# EAGLE board MAIN_FM (EAGLE 5.11), part 1 of 2
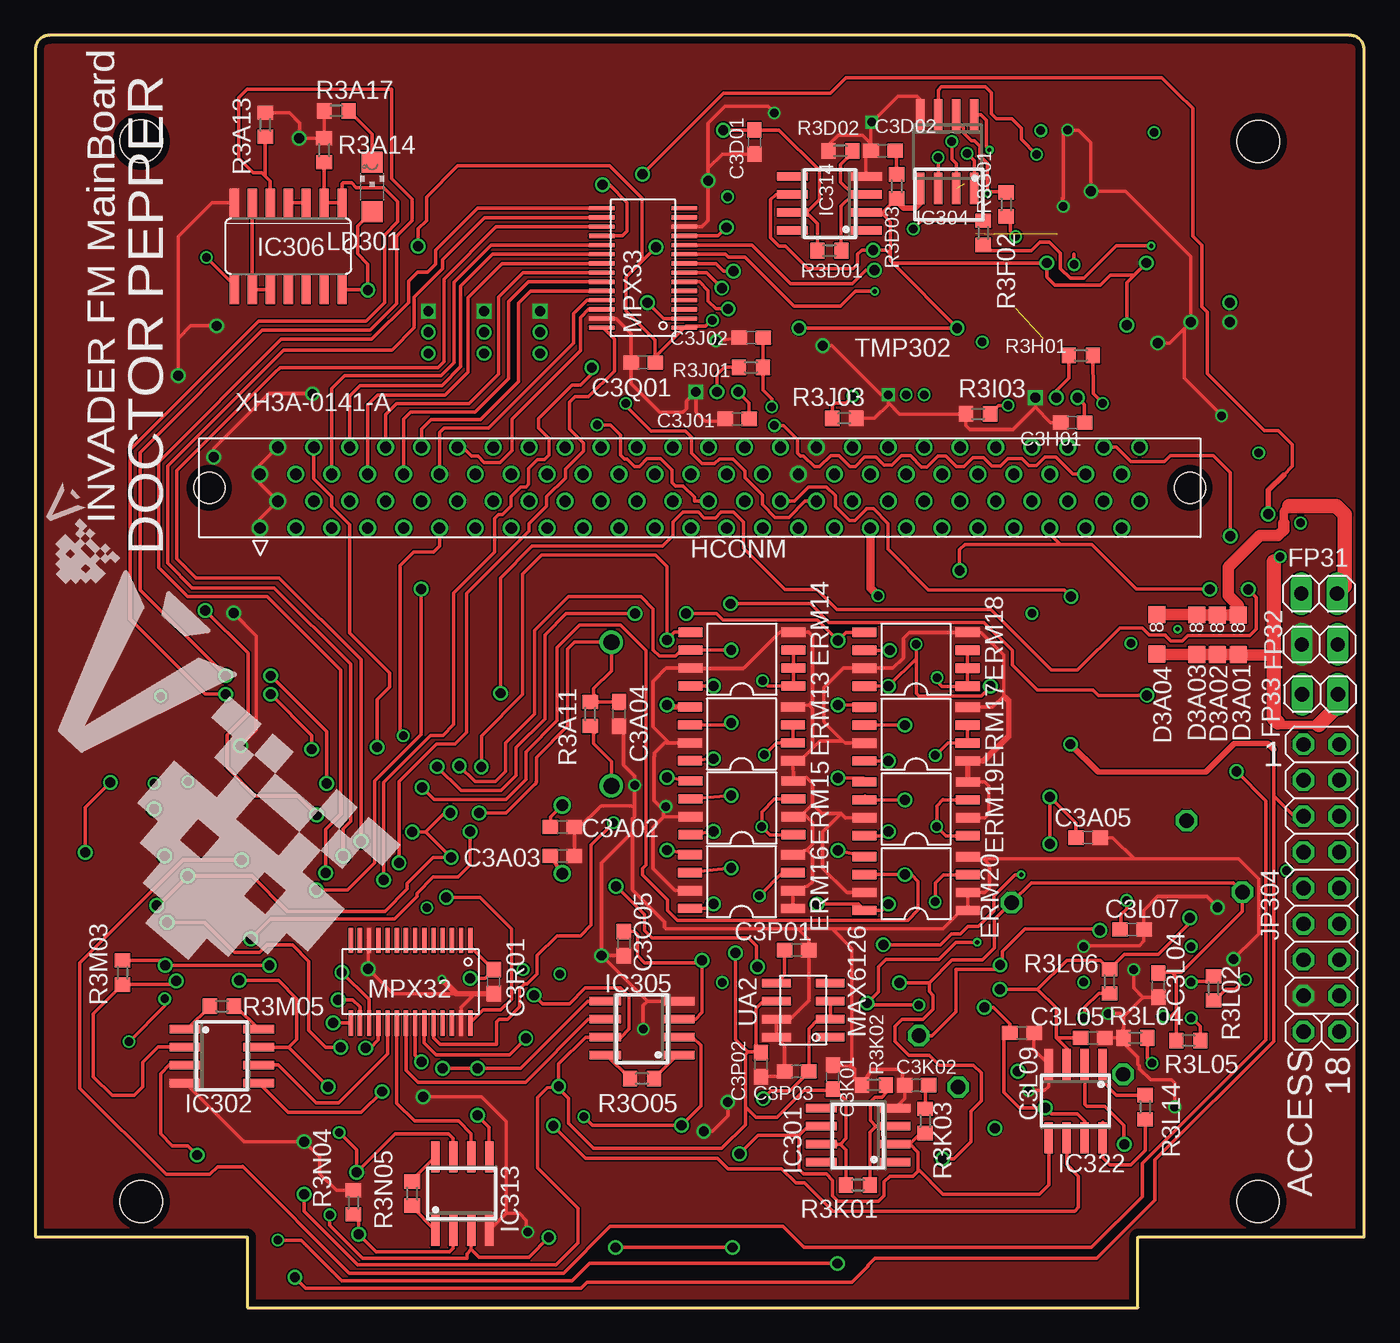
[diagram p7: board, top side]
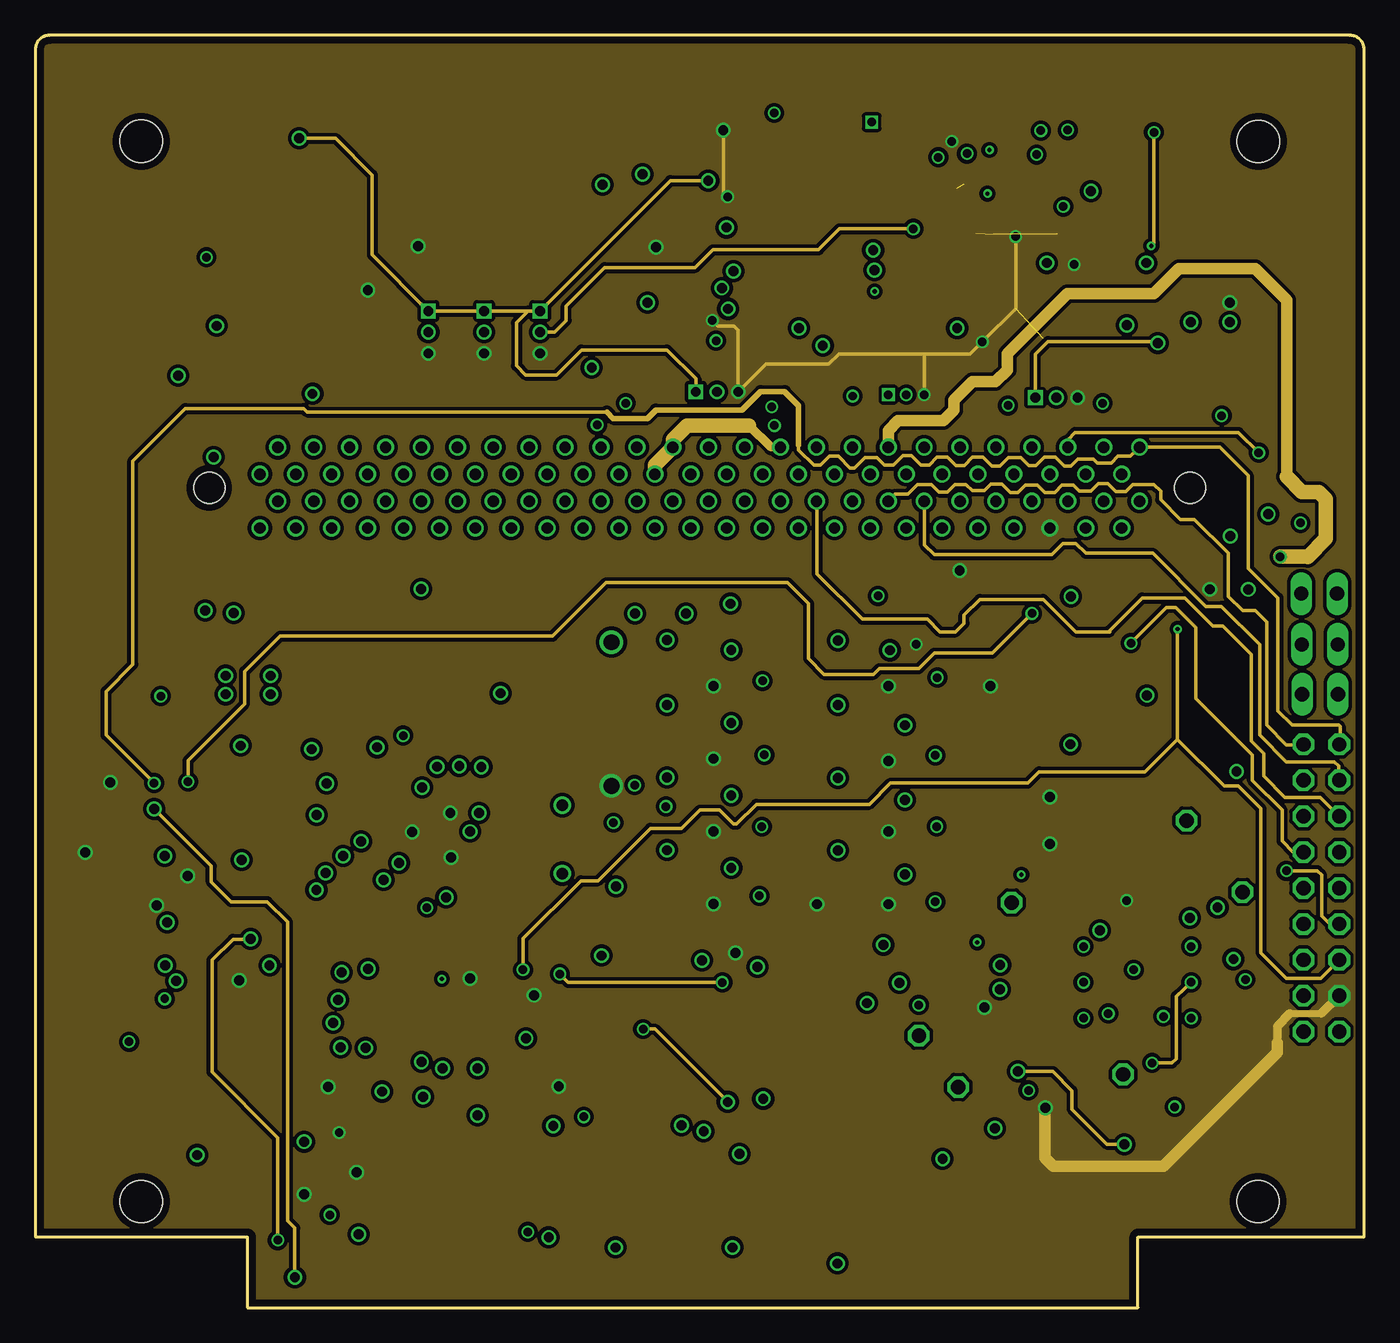
[diagram p8: board, inner layer Route2]
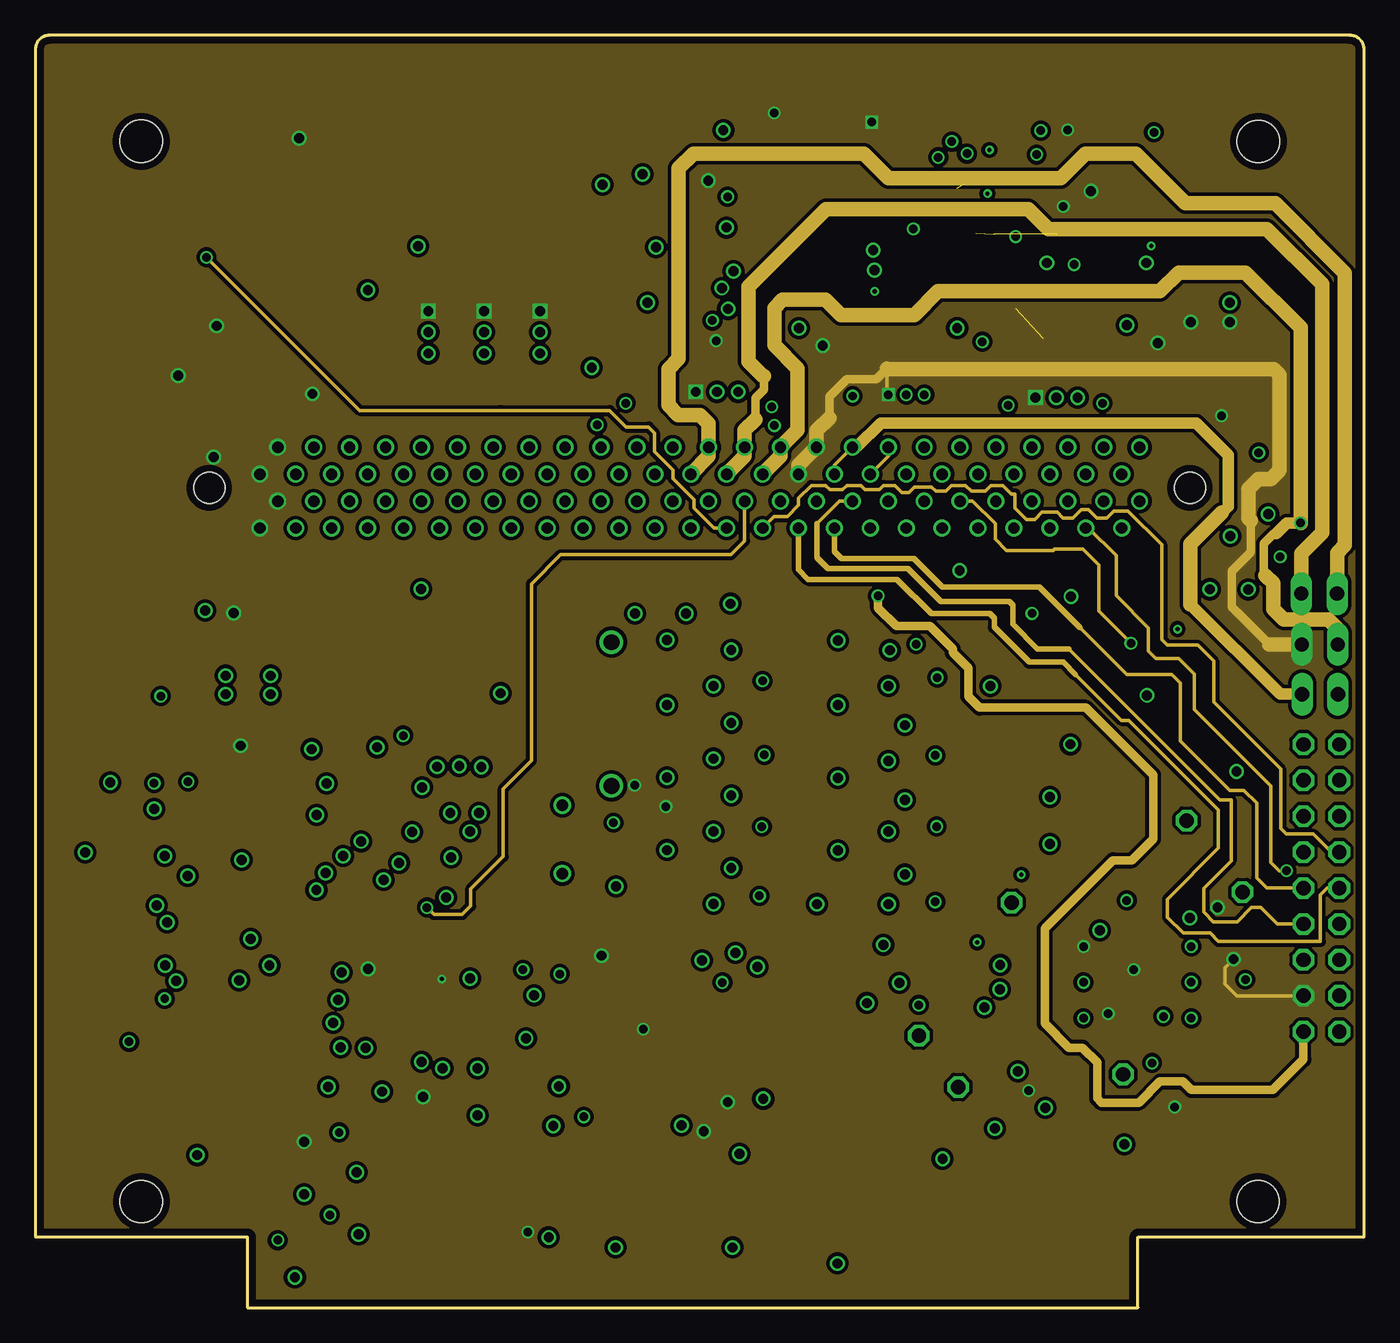
[diagram p9: board, inner layer Route15]
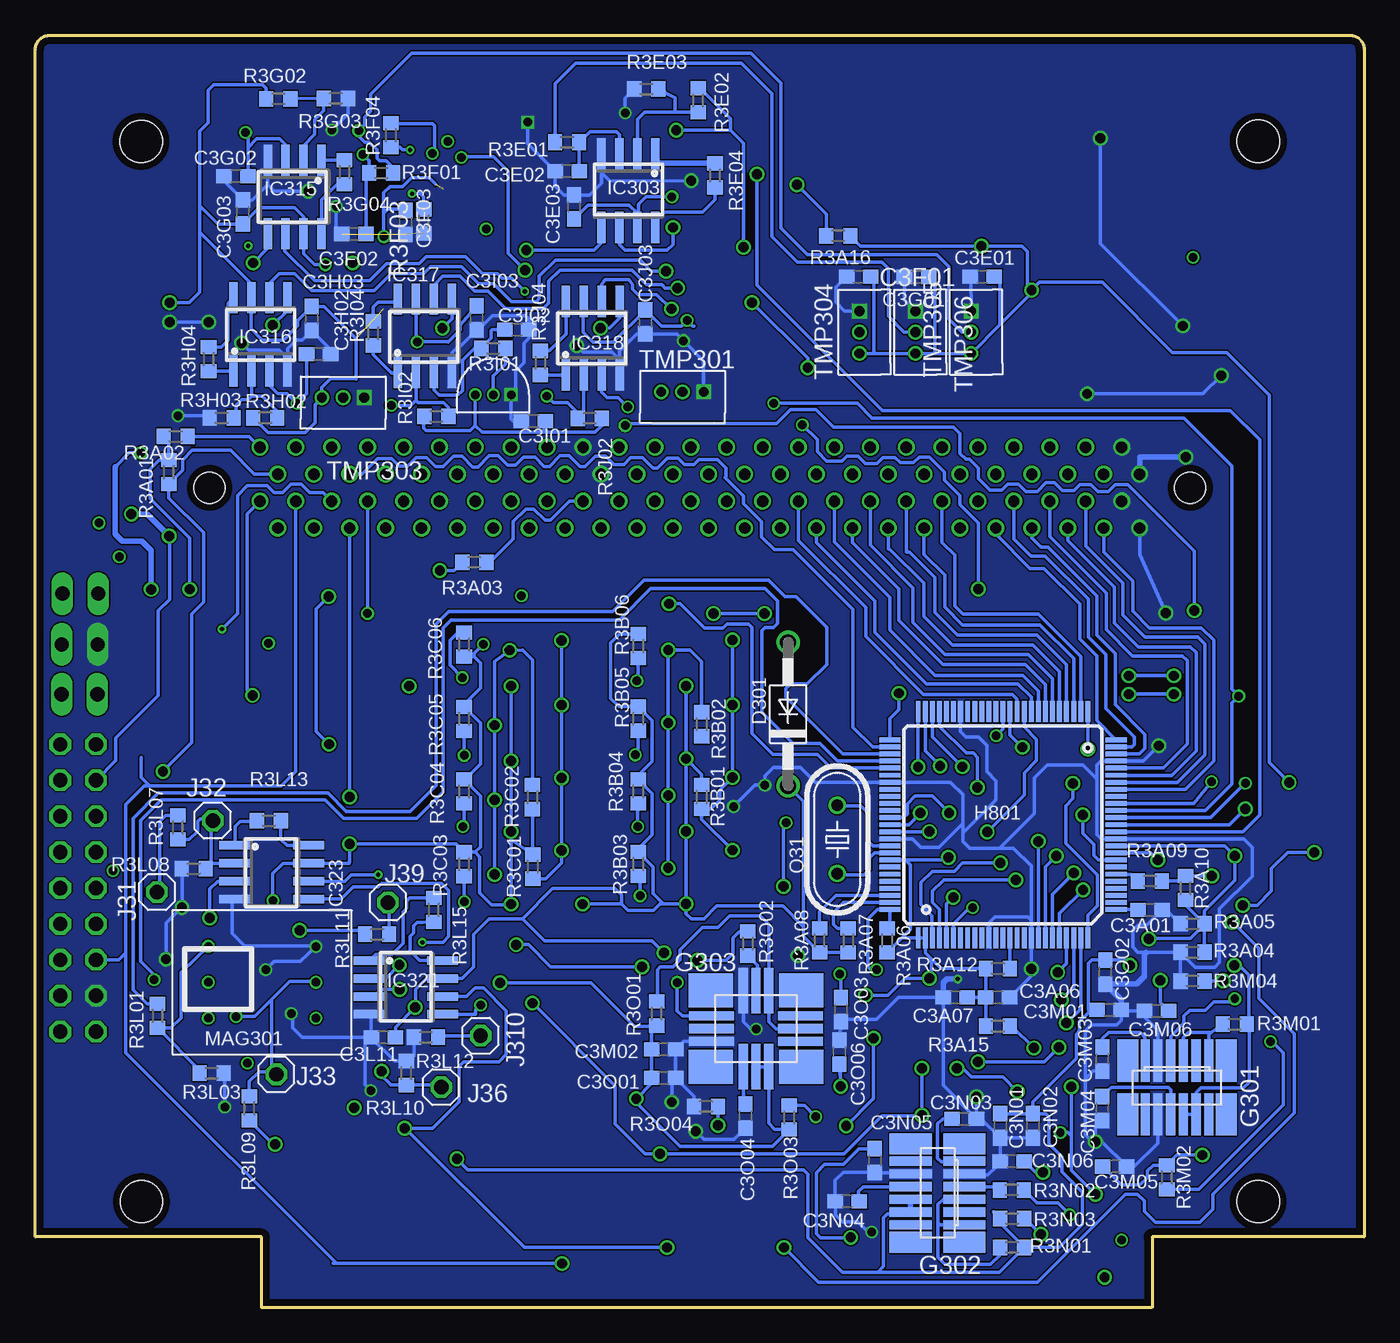
[diagram p10: board, bottom side, seen from below]

Size 94 x 90 mm. Coordinates in mm from the lower left corner, seen from the top.
Outline: 0,5 15,5 15,0 78,0 78,5 94,5 94,89 arc92 92.97,90 1,90 arc90 0,89 0,5
Copper layers (1+2*15+16): Top 0.018mm / dielectric 0.25mm / Route2 0.035mm / dielectric 1mm / Route15 0.035mm / dielectric 0.25mm / Bottom 0.018mm
Design rules "pban_4mil-l4": minimum track width 0.1mm, minimum drill 0.3mm, track to track 0.1mm, track to pad 0.229mm, pad to pad 0.1mm, via to via 0.1mm, smd to smd 0.1mm, copper to edge 0.5mm, drill to drill 0.5mm, minimum pad ring 0.15mm, minimum via ring 0.15mm, stop-mask expansion 4mil, vias tented up to drill 0.35mm, thermal gap 10mil
Holes 3 mm at 86.52,82.49 86.49,7.5 7.5,7.5 7.49,82.5

## Footprints (pad centres in the part's own frame; a part is rotated, then mirrored left to right if it is on the bottom)
C0603 = smd 1.1 x 1: 1 -0.85,0; 2 0.85,0
DIODE_FM = smd 1.2 x 1.2: P$1 -1.4,0; P$2 1.4,0
DO41-10 = drill 1.118 round: A 5.08,0; C -5.08,0
SOIC8 = smd 0.65 x 1.7: 1 -1.9,-3.65; 2 -0.63,-3.65; 3 0.64,-3.65; 4 1.91,-3.65; 5 1.91,3.65; 6 0.64,3.65; 7 -0.63,3.65; 8 -1.9,3.65
1X02 = drill 1.016 long: 1 -1.27,0; 2 1.27,0
CRM200 = smd 3 x 0.65: BIT_OUT -1.92,1.31; BW_CAP -1.92,-2.29; CBIT 1.88,2.21; MODE_SEL -1.92,-1.39; PROG 1.88,0.41; RATE_OUT -1.92,-0.49; RESET 1.88,-2.29; SEL0 -1.92,2.21; SEL1 -1.92,0.41; VDD 1.88,1.31; VREF_CAP 1.88,-0.49; VSS 1.88,-1.39 | smd 3 x 1.5: NEC1 -1.92,3.44; NEC2 -1.92,-3.52; NEC3 1.88,-3.52; NEC4 1.88,3.44
CRM100 = smd 3.2 x 0.65: BIT_OUT -3.15,-0.97; BW_CAP 3.15,-0.97; CBIT -3.15,0.83; RESET 3.15,-0.07; SEL0 -3.15,-0.07; VSS 3.15,0.83 | smd 0.65 x 3.2: MODE_SEL 0.9,-2.76; PROG 0,2.62; RATE_OUT 0,-2.76; SEL1 -0.9,-2.76; VDD -0.9,2.62; VREF_CAP 0.9,2.62 | smd 3.15 x 2.4: NEC1 -3.2,2.63; NEC2 -3.2,-2.77; NEC3 3.2,-2.77; NEC4 3.2,2.63
H8-3069 = smd 1.5 x 0.35: 1 -8,6; 2 -8,5.5; 3 -8,5; 4 -8,4.5; 5 -8,4; 6 -8,3.5; 7 -8,3; 8 -8,2.5; 9 -8,2; 10 -8,1.5; 11 -8,1; 12 -8,0.5; 13 -8,0; 14 -8,-0.5; 15 -8,-1; 16 -8,-1.5; 17 -8,-2; 18 -8,-2.5; 19 -8,-3; 20 -8,-3.5; 21 -8,-4; 22 -8,-4.5; 23 -8,-5; 24 -8,-5.5; 25 -8,-6; 51 8,-6; 52 8,-5.5; 53 8,-5; 54 8,-4.5; 55 8,-4; 56 8,-3.5; 57 8,-3; 58 8,-2.5; 59 8,-2; 60 8,-1.5; 61 8,-1; 62 8,-0.5; 63 8,0; 64 8,0.5; 65 8,1; 66 8,1.5; 67 8,2; 68 8,2.5; 69 8,3; 70 8,3.5; 71 8,4; 72 8,4.5; 73 8,5; 74 8,5.5; 75 8,6 | smd 0.35 x 1.5: 26 -6,-8; 27 -5.5,-8; 28 -5,-8; 29 -4.5,-8; 30 -4,-8; 31 -3.5,-8; 32 -3,-8; 33 -2.5,-8; 34 -2,-8; 35 -1.5,-8; 36 -1,-8; 37 -0.5,-8; 38 0,-8; 39 0.5,-8; 40 1,-8; 41 1.5,-8; 42 2,-8; 43 2.5,-8; 44 3,-8; 45 3.5,-8; 46 4,-8; 47 4.5,-8; 48 5,-8; 49 5.5,-8; 50 6,-8; 76 6,8; 77 5.5,8; 78 5,8; 79 4.5,8; 80 4,8; 81 3.5,8; 82 3,8; 83 2.5,8; 84 2,8; 85 1.5,8; 86 1,8; 87 0.5,8; 88 0,8; 89 -0.5,8; 90 -1,8; 91 -1.5,8; 92 -2,8; 93 -2.5,8; 94 -3,8; 95 -3.5,8; 96 -4,8; 97 -4.5,8; 98 -5,8; 99 -5.5,8; 100 -6,8
XH3A-0141-A = drill 0.8 round: A1 -31.115,-2.857; A2 -29.845,-0.953; A3 -28.575,-2.857; A4 -27.305,-0.953; A5 -26.035,-2.857; A6 -24.765,-0.953; A7 -23.495,-2.857; A8 -22.225,-0.953; A9 -20.955,-2.857; A10 -19.685,-0.953; A11 -18.415,-2.857; A12 -17.145,-0.953; A13 -15.875,-2.857; A14 -14.605,-0.953; A15 -13.335,-2.857; A16 -12.065,-0.953; A17 -10.795,-2.857; A18 -9.525,-0.953; A19 -8.255,-2.857; A20 -6.985,-0.953; A21 -5.715,-2.857; A22 -4.445,-0.953; A23 -3.175,-2.857; A24 -1.905,-0.953; A25 -0.635,-2.857; A26 0.635,-0.953; A27 1.905,-2.857; A28 3.175,-0.953; A29 4.445,-2.857; A30 5.715,-0.953; A31 6.985,-2.857; A32 8.255,-0.953; A33 9.525,-2.857; A34 10.795,-0.953; A35 12.065,-2.857; A36 13.335,-0.953; A37 14.605,-2.857; A38 15.875,-0.953; A39 17.145,-2.857; A40 18.415,-0.953; A41 19.685,-2.857; A42 20.955,-0.953; A43 22.225,-2.857; A44 23.495,-0.953; A45 24.765,-2.857; A46 26.035,-0.953; A47 27.305,-2.857; A48 28.575,-0.953; A49 29.845,-2.857; A50 31.115,-0.953; B1 -31.115,0.953; B2 -29.845,2.857; B3 -28.575,0.953; B4 -27.305,2.857; B5 -26.035,0.953; B6 -24.765,2.857; B7 -23.495,0.953; B8 -22.225,2.857; B9 -20.955,0.953; B10 -19.685,2.857; B11 -18.415,0.953; B12 -17.145,2.857; B13 -15.875,0.953; B14 -14.605,2.857; B15 -13.335,0.953; B16 -12.065,2.857; B17 -10.795,0.953; B18 -9.525,2.857; B19 -8.255,0.953; B20 -6.985,2.857; B21 -5.715,0.953; B22 -4.445,2.857; B23 -3.175,0.953; B24 -1.905,2.857; B25 -0.635,0.953; B26 0.635,2.857; B27 1.905,0.953; B28 3.175,2.857; B29 4.445,0.953; B30 5.715,2.857; B31 6.985,0.953; B32 8.255,2.857; B33 9.525,0.953; B34 10.795,2.857; B35 12.065,0.953; B36 13.335,2.857; B37 14.605,0.953; B38 15.875,2.857; B39 17.145,0.953; B40 18.415,2.857; B41 19.685,0.953; B42 20.955,2.857; B43 22.225,0.953; B44 23.495,2.857; B45 24.765,0.953; B46 26.035,2.857; B47 27.305,0.953; B48 28.575,2.857; B49 29.845,0.953; B50 31.115,2.857 | hole 2.2: -34.7,0; 34.67,0
SO8 = smd 0.6 x 2.2: 1 -1.905,-2.6; 2 -0.635,-2.6; 3 0.635,-2.6; 4 1.905,-2.6; 5 1.905,2.6; 6 0.635,2.6; 7 -0.635,2.6; 8 -1.905,2.6
SO14 = smd 0.66 x 2.032: 1 -3.81,-3.073; 2 -2.54,-3.073; 3 -1.27,-3.073; 4 0,-3.073; 5 1.27,-3.073; 6 2.54,-3.073; 7 3.81,-3.073; 8 3.81,3.073; 9 2.54,3.073; 10 1.27,3.073; 11 0,3.073; 12 -1.27,3.073; 13 -2.54,3.073; 14 -3.81,3.073
1X01 = drill 1.016 octagon: 1 0,0
2X08 = drill 1.016 octagon: 1 -8.89,-1.27; 2 -8.89,1.27; 3 -6.35,-1.27; 4 -6.35,1.27; 5 -3.81,-1.27; 6 -3.81,1.27; 7 -1.27,-1.27; 8 -1.27,1.27; 9 1.27,-1.27; 10 1.27,1.27; 11 3.81,-1.27; 12 3.81,1.27; 13 6.35,-1.27; 14 6.35,1.27; 15 8.89,-1.27; 16 8.89,1.27
CHIPLED_1206 = smd 1.5 x 1.5: A 0,-1.75; C 0,1.75
AMI302 = drill 0.6 round: CH1 -3.81,2.54; CH2 -3.81,0; CS -3.81,-2.54; GND 3.81,2.54; VDD 3.81,0; VO 3.81,-2.54
ADG707 = smd 1.8 x 0.3: A0 2.925,-2.925; A1 2.925,-3.575; A2 2.925,-4.225; DA 2.925,4.225; DB -2.925,3.575; EN 2.925,-2.275; GND1 -2.925,-2.925; GND2 2.925,3.575; NC -2.925,-3.575; NC1 -2.925,2.925; NC2 -2.925,-4.225; S1A 2.925,-1.625; S1B -2.925,-2.275; S2A 2.925,-0.975; S2B -2.925,-1.625; S3A 2.925,-0.325; S3B -2.925,-0.975; S4A 2.925,0.325; S4B -2.925,-0.325; S5A 2.925,0.975; S5B -2.925,0.325; S6A 2.925,1.625; S6B -2.925,0.975; S7A 2.925,2.275; S7B -2.925,1.625; S8A 2.925,2.925; S8B -2.925,2.275; VDD -2.925,4.225
HC49/S = drill 0.813 round: 1 -2.413,0; 2 2.413,0
R0603 = smd 1 x 1.1: 1 -0.85,0; 2 0.85,0
LM19_XH = drill 0.7 round: 1 -1.5,0; 2 0,0 | drill 0.7 square: 3 1.5,0
LM19 = drill 0.6 round: +VS 1.27,0; VOUT 0,0 | drill 0.6 square: GND -1.27,0
MAX6126 = smd 0.61 x 2.032: GND -1.27,2.54; GNDS -2.54,2.54; I.C.1 1.27,-1.27; I.C.2 -2.54,-1.27; IN 0,2.54; NR 1.27,2.54; OUTF 0,-1.27; OUTS -1.27,-1.27

## Placement (x,y rotation side)
C3A01  0.1u  [C0603]  15.15,28.14 0 bottom
C3A02  15pF  [C0603]  37.28,34 0 top
C3A03  15pF  [C0603]  37.28,31.95 0 top
C3A04  10uF  [C0603]  41.28,41.99 270 top
C3A05  10u  [C0603]  74.46,33.24 0 top
C3A06  0.1u  [C0603]  25.91,21.94 0 bottom
C3A07  0.1u  [C0603]  28.93,21.94 180 bottom
C3D01  0.1u  [C0603]  50.86,82.45 270 top
C3D02  1n  [C0603]  59.96,81.83 180 top
C3E01  0.1u  [C0603]  27.02,72.94 180 bottom
C3E02  10u  [C0603]  56.38,80.4 180 bottom
C3E03  0.1u  [C0603]  55.89,77.86 90 bottom
C3F01  0.1u  [C0603]  35.77,72.94 180 bottom
C3F02  10u  [C0603]  71.46,75.95 180 bottom
C3F03  0.1u  [C0603]  67.81,76.77 270 bottom
C3G01  0.1u  [C0603]  31.67,72.91 180 bottom
C3G02  10u  [C0603]  79.81,80.03 180 bottom
C3G03  0.1u  [C0603]  79.32,77.51 90 bottom
C3H01  0.1u  [C0603]  73.37,62.6 180 top
C3H02  10u  [C0603]  73.96,67.45 0 bottom
C3H03  0.1u  [C0603]  74.45,69.97 270 bottom
C3I01  0.1u  [C0603]  58.77,62.71 180 bottom
C3I02  10u  [C0603]  59.93,69.18 0 bottom
C3I03  0.1u  [C0603]  62.78,70.01 270 bottom
C3J01  0.1u  [C0603]  49.65,62.87 180 top
C3J02  10u  [C0603]  50.65,68.61 180 top
C3J03  0.1u  [C0603]  50.85,69.72 270 bottom
C3K01  0.1u  [C0603]  56.41,16.3 90 top
C3K02  1n  [C0603]  62.35,15.74 180 top
C3L04  10u  [C0603]  79.43,22.8 270 top
C3L05  10u  [C0603]  74.8,19.08 0 top
C3L07  0.1u  [C0603]  77.58,26.75 0 top
C3L09  0.1u  [C0603]  69.79,19.43 0 top
C3L11  0.1u  [C0603]  69.38,19.12 180 bottom
C3M01  0.1u  [C0603]  18.04,21.07 0 bottom
C3M02  10u  [C0603]  49.56,18.27 0 bottom
C3M03  0.1u(47n?)  [C0603]  18.51,17.58 270 bottom
C3M04  0.1u  [C0603]  18.54,14.09 270 bottom
C3M05  10u  [C0603]  17.64,9.98 0 bottom
C3M06  0.1u  [C0603]  14.67,20.99 180 bottom
C3N01  0.1u  [C0603]  25.75,12.86 270 bottom
C3N02  10u  [C0603]  23.43,12.86 270 bottom
C3N03  0.1u(47n?)  [C0603]  28.28,13.36 0 bottom
C3N04  0.1u  [C0603]  36.57,7.52 180 bottom
C3N05  10u  [C0603]  34.63,10.4 270 bottom
C3N06  0.1u  [C0603]  24.9,10.34 180 bottom
C3O01  0.1u  [C0603]  49.56,16.24 0 bottom
C3O02  10u  [C0603]  18.3,23.73 270 bottom
C3O03  0.1u(47n?)  [C0603]  37.01,21.09 270 bottom
C3O04  0.1u  [C0603]  43.77,13.55 270 bottom
C3O05  10u  [C0603]  41.63,25.75 270 top
C3O06  0.1u  [C0603]  37.11,18.08 90 bottom
C3P01  0.1u  [C0603]  53.86,25.29 0 top
C3P02  0.1u  [C0603]  51.33,17.2 270 top
C3P03  0.1u  [C0603]  53.86,16.71 180 top
C3Q01  0.1u  [C0603]  43,66.86 0 top
C3R01  0.1u  [C0603]  32.43,23.05 90 top
D3A01  DIODE_FM  [DIODE_FM]  85.1,47.6 90 top
D3A02  DIODE_FM  [DIODE_FM]  83.62,47.6 90 top
D3A03  DIODE_FM  [DIODE_FM]  82.16,47.61 90 top
D3A04  DIODE_FM  [DIODE_FM]  79.34,47.63 90 top
D301  1N4004  [DO41-10]  40.75,41.99 90 bottom
ERM13  24LC1025  [SOIC8]  49.96,40.58 90 top
ERM14  24LC1025  [SOIC8]  49.98,45.87 90 top
ERM15  24LC1025  [SOIC8]  49.98,35.35 90 top
ERM16  24LC1025  [SOIC8]  49.95,30.13 90 top
ERM17  24LC1025  [SOIC8]  62.3,40.56 90 top
ERM18  24LC1025  [SOIC8]  62.3,45.86 90 top
ERM19  24LC1025  [SOIC8]  62.31,35.28 90 top
ERM20  24LC1025  [SOIC8]  62.31,29.99 90 top
FP31  [1X02]  90.82,50.51 180 top
FP32  [1X02]  90.86,46.91 180 top
FP33  [1X02]  90.88,43.4 0 top
G301  CRM200  [CRM200]  13.2,15.55 270 bottom
G302  CRM200  [CRM200]  30.2,8.07 180 bottom
G303  CRM100  [CRM100]  43.02,19.66 180 bottom
H801  H8-3069  [H8-3069]  25.55,34.16 180 bottom
HCONM  XH3A-0141-A_NEW  [XH3A-0141-A]  47,58 0 top
IC301  AD8541R  [SO8]  58.2,12.2 90 top
IC302  AD623R  [SO8]  13.2,17.8 270 top
IC303  AD623R  [SO8]  52.05,79.01 180 bottom
IC304  AD623R  [SO8]  64.51,81.77 180 top
IC305  AD623R  [SO8]  42.92,19.76 90 top
IC306  7400D  [SO14]  17.89,75.08 180 top
IC313  AD623R  [SO8]  30.2,8.07 0 top
IC314  AD8541R  [SO8]  56.17,78.11 90 top
IC315  AD623R  [SO8]  75.66,78.58 180 bottom
IC316  AD623R  [SO8]  78.07,68.84 0 bottom
IC317  AD623R  [SO8]  66.44,68.73 0 bottom
IC318  AD623R  [SO8]  54.57,68.58 0 bottom
IC321  AD623R  [SO8]  67.78,22.65 270 bottom
IC322  AD623R  [SO8]  73.59,14.6 180 top
IC323  AD623R  [SO8]  77.28,30.8 270 bottom
J31  [1X01]  85.39,29.39 180 bottom
J32  [1X01]  81.45,34.45 180 bottom
J33  [1X01]  76.95,16.5 180 bottom
J36  [1X01]  65.29,15.6 180 bottom
J39  [1X01]  69.05,28.65 180 bottom
J310  [1X01]  62.5,19.23 180 bottom
JP2  [1X01]  92.24,19.51 0 top
JP3  [1X01]  89.7,19.51 0 top
JP304  [2X08]  90.97,30.95 270 top
LD301  [CHIPLED_1206]  23.82,79.28 0 top
MAG301  AM302  [AMI302]  77.96,23.01 0 bottom
MPX32  ADG707  [ADG707]  26.54,23.05 270 top
MPX33  ADG707  [ADG707]  42.99,73.54 180 top
Q31  [HC49/S]  37.27,33.12 270 bottom
R3A01  1k  [R0603]  84.56,59.1 90 bottom
R3A02  1k  [R0603]  84.07,61.62 180 bottom
R3A03  1k  [R0603]  62.95,52.73 180 bottom
R3A04  4.7k  [R0603]  12.14,25.13 180 bottom
R3A05  4.7k  [R0603]  12.14,27.15 180 bottom
R3A06  47k  [R0603]  33.74,25.97 270 bottom
R3A07  47k  [R0603]  36.49,25.97 270 bottom
R3A08  47k  [R0603]  38.52,25.97 270 bottom
R3A09  47k  [R0603]  15.15,30.17 0 bottom
R3A10  47k  [R0603]  12.64,29.68 90 bottom
R3A11  47k  [R0603]  39.25,41.99 270 top
R3A12  47k  [R0603]  25.91,23.98 180 bottom
R3A13  1k  [R0603]  16.26,83.67 270 top
R3A14  1k  [R0603]  20.43,81.87 270 top
R3A15  1k  [R0603]  25.91,19.91 0 bottom
R3A16  1k  [R0603]  37.2,75.81 180 bottom
R3A17  1k  [R0603]  21.3,84.66 180 top
R3B01  1k  [R0603]  46.86,36.13 90 bottom
R3B02  1k  [R0603]  46.86,41.27 270 bottom
R3B03  1k  [R0603]  51.35,31.38 90 bottom
R3B04  1k  [R0603]  51.35,36.52 90 bottom
R3B05  1k  [R0603]  51.35,41.66 90 bottom
R3B06  1k  [R0603]  51.35,46.8 90 bottom
R3C01  1k  [R0603]  58.81,31.19 90 bottom
R3C02  1k  [R0603]  58.83,36.11 270 bottom
R3C03  1k  [R0603]  63.67,31.37 90 bottom
R3C04  1k  [R0603]  63.67,36.51 90 bottom
R3C05  1k  [R0603]  63.67,41.65 90 bottom
R3C06  1k  [R0603]  63.67,46.91 270 bottom
R3D01  100k  [R0603]  56.17,74.77 180 top
R3D02  100k  [R0603]  56.96,81.83 0 top
R3D03  200  [R0603]  60.93,79.31 90 top
R3E01  820  [R0603]  56.38,82.44 180 bottom
R3E02  2k  [R0603]  47.12,85.4 270 bottom
R3E03  1k  [R0603]  50.78,86.2 0 bottom
R3E04  33k  [R0603]  45.92,80.09 270 bottom
R3F01  820  [R0603]  69.54,80.26 0 bottom
R3F02  2k  [R0603]  68.68,78.04 90 top
R3F03  1k  [R0603]  66.52,76.84 90 bottom
R3F04  33k  [R0603]  68.85,82.94 90 bottom
R3G01  820  [R0603]  67.06,76.03 90 top
R3G02  2k  [R0603]  76.81,85.51 0 bottom
R3G03  1k  [R0603]  72.74,85.54 180 bottom
R3G04  33k  [R0603]  72.13,80.33 270 bottom
R3H01  820  [R0603]  73.96,67.35 180 top
R3H02  2k  [R0603]  77.74,62.94 0 bottom
R3H03  1k  [R0603]  80.82,62.93 0 bottom
R3H04  33k  [R0603]  81.74,67.09 90 bottom
R3I01  820  [R0603]  61.6,67.85 0 bottom
R3I02  2k  [R0603]  65.63,63.04 0 bottom
R3I03  1k  [R0603]  66.69,63.22 0 top
R3I04  33k  [R0603]  70.1,68.92 90 bottom
R3J01  820  [R0603]  50.62,66.5 180 top
R3J02  2k  [R0603]  54.78,62.92 180 bottom
R3J03  1k  [R0603]  57.22,62.91 180 top
R3J04  33k  [R0603]  58.27,66.83 90 bottom
R3K01  100k  [R0603]  58.2,8.67 180 top
R3K02  100k  [R0603]  59.32,15.75 0 top
R3K03  200  [R0603]  62.95,13.2 90 top
R3L01  10k  [R0603]  85.36,20.63 270 bottom
R3L02  10k  [R0603]  83.34,22.58 90 top
R3L03  15k  [R0603]  81.52,16.58 0 bottom
R3L04  15k  [R0603]  77.81,19.08 180 top
R3L05  1k  [R0603]  81.57,18.9 0 top
R3L06  820  [R0603]  75.98,23.08 270 top
R3L07  10k  [R0603]  83.92,33.96 90 bottom
R3L08  10k  [R0603]  82.8,31.04 0 bottom
R3L09  10k  [R0603]  78.86,14.1 90 bottom
R3L10  10k  [R0603]  67.76,16.59 270 bottom
R3L11  10k  [R0603]  69.83,26.41 0 bottom
R3L12  10k  [R0603]  66.37,19.12 0 bottom
R3L13  11k  [R0603]  77.48,34.44 0 bottom
R3L14  11k  [R0603]  78.51,14.18 270 top
R3L15  11k  [R0603]  65.82,28.13 270 bottom
R3M01  1k  [R0603]  9.16,20.04 180 bottom
R3M02  820  [R0603]  13.96,9.22 90 bottom
R3M03  10k  [R0603]  6.17,23.7 90 top
R3M04  10k  [R0603]  12.14,23.1 180 bottom
R3M05  3.9k  [R0603]  13.2,21.32 0 top
R3N01  1k  [R0603]  24.9,4.26 180 bottom
R3N02  820  [R0603]  24.92,8.32 0 bottom
R3N03  10k  [R0603]  24.9,6.29 180 bottom
R3N04  10k  [R0603]  22.51,7.44 90 top
R3N05  3.9k  [R0603]  26.65,8.07 90 top
R3O01  1k  [R0603]  50.05,20.8 90 bottom
R3O02  820  [R0603]  43.6,25.75 90 bottom
R3O03  10k  [R0603]  40.67,13.45 270 bottom
R3O04  10k  [R0603]  46.56,14.23 180 bottom
R3O05  3.9k  [R0603]  42.91,16.21 180 top
TMP301  LM19_ZH  [LM19_XH]  48.22,64.78 0 bottom
TMP302  LM19  [LM19]  61.61,64.58 0 top
TMP303  LM19_ZH  [LM19_XH]  72.23,64.37 0 bottom
TMP304  LM19_ZH  [LM19_XH]  35.7,69 90 bottom
TMP305  LM19_ZH  [LM19_XH]  27.8,69 90 bottom
TMP306  LM19_ZH  [LM19_XH]  31.74,69 90 bottom
UA2  MAX6126  [MAX6126]  54.96,21.67 90 top

## Tracks (layer width: path | path; a pad name or v marks a point on that pad's centre or on a via)
0-A0  (via drill 0.7)
  Top 0.254: MPX33.A0 32.61,76.47 28.9,72.76 28.9,66.92 28.48,66.5 17.3,66.5 16.93,66.13 10,59.21 10,53 11.38,51.62 17.26,51.62 23.05,45.83 v23.05,32.99
  Bottom 0.254: H801.93 v23.05,32.99
0-A1  (via drill 0.7)
  Top 0.254: v21.78,31.94 21.78,33.88 22.3,34.39 22.3,45.53 16.91,50.92 11.11,50.92 9.36,52.67 9.36,59.52 17.58,67.74 25.24,67.74 26.81,69.31 26.81,71.49 28.82,73.5 28.82,74.14 31.8,77.11 MPX33.A1
  Bottom 0.254: H801.94 22.55,31.17 v21.78,31.94
0-A2  (via drill 0.7)
  Top 0.254: v20.54,30.75 20.54,33.83 21.6,34.89 21.6,45.09 16.4,50.29 10.77,50.29 8.71,52.35 8.71,59.82 17.39,68.5 23.8,68.5 26.39,71.09 26.39,72.61 27.04,73.26 27.74,73.26 28.31,73.83 28.31,74.8 31.27,77.77 MPX33.A2
  Bottom 0.254: H801.95 22.05,29.24 v20.54,30.75
0-DA  (via drill 0.7)
  Top 0.254: MPX33.DA arc-45 40.24,69.24 40.96,68.52 40.96,66.26 39.13,64.43 38.18,64.43 37.79,64.04 37.79,62.13 38.77,61.15 38.77,60.59 37.49,59.31 37.49,58.69 36.17,57.37 36.17,56.7 34.94,55.47 34.94,54.94 30.51,50.51 30.51,40.69 29.69,39.87 28.38,39.87 25.72,37.21 v25.72,31.46
  Bottom 0.254: H801.78 30.56,27.72 31.35,28.51 31.35,30.07 30.55,30.87 29,30.87 28.41,31.46 v25.72,31.46
0-DB  (via drill 0.7)
  Top 0.254: MPX33.DB 44.44,69.97 v43.3,71.1 | v39.36,66.5 39.36,66.03 38.57,65.24 37.95,65.24 35.61,62.9 35.61,62.2 36.34,61.47 36.34,60.3 36.02,59.98 35.54,59.98 34.9,59.34 34.9,58.24 34.71,58.05 34.33,58.05 33.67,57.39 33.67,56.7 33.06,56.09 32.76,56.09 32.5,55.83 32.5,53.46 29.6,50.56 29.6,41.24 28.83,40.47 27.96,40.47 24.64,37.15 v24.64,30.26
  Bottom 0.254: H801.79 30.05,28.17 30.53,28.65 30.53,29.47 29.81,30.19 arc45 29.64,30.26 v24.64,30.26 | v39.36,66.5 39.36,67.16 v43.3,71.1
0-REF2  (via drill 0.7)
  Top 0.254: IC314.6 52.38,78.75 52,78.37 52,75.7 52.6,75.1 53.06,75.1 54.65,73.51 57.85,73.51 58.17,73.83 58.17,74.52 58.46,74.81 v59.27,74.81 60.19,74.81 60.5,74.5 | 59.95,77.47 IC314.2 | 59.95,77.47 R3D03.1 | 59.95,77.47 59.95,77.36 60.5,76.8 60.5,74.5 | 60.66,73.9 v65.21,69.3 v54.03,69.3 | 60.66,73.9 v71.56,73.9 71.56,72.88 72.12,72.32 75.35,72.32 76.05,73.02 77.72,73.02 v78.6,73.9 77.21,72.51 v77.21,69.49 | 60.5,74.5 60.5,74.06 60.66,73.9
  Top 0.406: IC304.5 62.6,78.17 62.21,77.77 61.46,77.77 60.93,78.3 R3D03.1
  Bottom 0.254: IC303.5 54,76.67 54,75.3 54.49,74.81 v59.27,74.81 | IC316.5 76.17,70.53 v77.21,69.49 | IC315.5 77.56,74.94 v78.6,73.9 | IC318.5 52.66,70 53.37,69.3 v54.03,69.3 | IC317.5 64.53,69.97 v65.21,69.3
1-A0  (via drill 0.7)
  Top 0.254: MPX32.A0 23.61,21.79 v21.68,23.72
  Bottom 0.254: H801.97 21.05,24.45 arc45 21.12,24.28 v21.68,23.72
1-A1  (via drill 0.7)
  Top 0.254: v21.42,21.78 22.46,21.78 22.96,21.28 MPX32.A1
  Bottom 0.254: H801.98 20.55,22.76 arc45 20.62,22.58 v21.42,21.78
1-A2  (via drill 0.7)
  Top 0.254: v21.06,20.13 MPX32.A2 arc-45 MPX32.A2
  Bottom 0.254: H801.99 20.05,21.24 arc45 20.12,21.07 v21.06,20.13
1-DA  (via drill 0.7)
  Top 0.254: 30.77,20.3 MPX32.DA 31.69,21.05 32.92,21.05 33.68,21.81 33.68,26.8 31.46,29.02 v29.07,29.02
  Bottom 0.254: H801.80 29.55,28.54 v29.07,29.02
1-REF1  (via drill 0.3, 0.6, 0.7)
  Top 0.254: R3K03.1 62.64,12.35 61.86,11.57 | 61.86,11.57 IC301.2 | IC301.6 54.66,12.84 54.02,12.2 | 54.02,12.2 54.02,9.77 54.33,9.46 55.96,9.46 56.4,9.02 56.4,7.9 56.79,7.51 59.64,7.51 60.03,7.9 60.03,8.89 60.44,9.3 62.09,9.3 62.43,9.64 62.43,9.8 | 61.86,11.57 62.43,11 62.43,9.8 | IC313.5 32.11,12.75 31.3,13.56 arc-45 v31.28,13.61 | IC305.5 39.06,21.66 34.33,16.93 v31.28,16.93 v28.81,16.93 | 54.02,12.2 51.13,12.2 49.82,10.89 arc45 v49.81,10.87 | 62.43,9.8 64.2,8.03 71.03,8.03 71.7,8.7 71.7,11.98 IC322.5 | v66.63,25.84 65.11,25.84 63.91,24.64 60.18,24.64 59.64,24.1 59.64,22.32 58.87,21.55 arc-45 v58.84,21.54 58.98,21.4 v62.5,21.4 | v24.53,15.28 23.05,13.8 17.89,13.8 IC302.5
  Bottom 0.254: v28.81,16.93 28.39,16.93 27.77,16.31 25.56,16.31 v24.53,15.28 | v31.28,16.93 v31.28,13.61 arc45 31.35,13.58 34.1,13.58 36.81,10.87 v49.81,10.87 50.87,10.87 53,13 53,15.7 v58.84,21.54 | IC323.5 72.38,28.89 71.52,29.75 69.75,29.75 69.5,30 65.25,30 64.75,29.5 64.75,26.25 65.16,25.84 v66.63,25.84 | IC321.5 62.85,20.74 62.85,21.05 v62.5,21.4
+3V3  (via drill 0.6, 0.7)
  Top 0.254: UA2.OUTF UA2.OUTS 55.37,20.39 54.71,19.73 C3P03.1 54.59,16.71 54.59,16.54 53.39,15.34 52.05,15.34 v51.49,14.78 | v16.56,24.22 v9.18,24.22 8.85,24.55 R3M03.2 | 63.23,22.98 64.83,24.58 66.99,24.58 67.86,25.45 67.86,27.46 J39.1 70.44,30.05 84.74,30.05 J31.1 85.39,28.03 81.06,23.7 80.4,23.7 | 80.72,21 80.72,23.38 80.4,23.7 | 80.72,21 R3L05.1 | 80.4,23.7 79.48,23.7 C3L04.1 | 63.23,22.98 v61.12,22.98 | v79.8,20.6 80.32,20.6 80.72,21 | 63.23,22.98 63.23,22.37 63.5,22.1 63.5,21.1 62.8,20.4 61.3,20.4 60.8,19.9 60.8,18.83 61.79,17.84 63.24,17.84 63.96,17.12 66.38,17.12 66.91,16.59 66.91,14.61 66.19,13.89 66.19,11.74 64.98,10.53 v64.18,10.53
  Bottom 0.254: R3L09.2 78.86,15.99 78.16,16.69 76.95,16.69 J33.1 76.95,16.71 77.3,17.06 77.3,21.8 | 26.22,6.76 R3N03.2 25.75,5.96 R3N01.1 | R3N01.1 | R3N01.1 25.81,2.5 33.98,2.5 33.99,2.51 34.4,2.51 | v9.18,24.22 8.94,24.22 arc45 8.76,24.15 8.15,23.54 8.15,20.04 R3M01.1 8.14,20.04 8.14,15.95 8.54,15.55 11.56,15.55 11.89,15.22 G301.VDD G301.PROG | 64.16,10.52 arc45 v64.18,10.53 63.41,9.76 39.68,9.76 39.35,9.43 39.35,4.93 36.92,2.5 34.94,2.5 34.93,2.51 | 16.76,24.22 v16.56,24.22 16.93,24.59 C3O02.1 19.27,24.59 19.52,24.34 19.52,21.11 19.48,21.07 | C3N02.1 C3N01.1 | C3N02.1 23.73,13.82 | 77.3,21.8 76.01,23.09 74.23,23.09 MAG301.VDD | 77.3,21.8 78.5,20.6 v79.8,20.6 | R3L07.2 84.79,34.81 85.2,34.4 85.2,29.59 J31.1 | G303.PROG G303.VDD 42.12,13.02 41.7,12.6 R3O03.2 41.87,11.4 48.4,11.4 51.49,14.49 v51.49,14.78 50.41,15.86 C3O01.1 C3M02.1 50.41,19.59 R3O01.1 50.1,19.9 51.6,19.9 54.68,22.98 v61.12,22.98 | R3N01.1 21.55,4.26 19.93,5.88 19.93,8.15 21.37,9.59 21.37,10.67 22.3,11.6 22.3,13.5 22.51,13.71 C3N02.1 | 34.4,2.51 34.93,2.51 | 34.93,2.51 35.43,2.51 | G302.VDD 32.21,6.63 33.73,6.63 33.99,6.37 33.99,2.92 34.4,2.51 | 19.48,21.07 C3M01.1 | 19.48,21.07 19.48,20.89 20.13,20.24 20.13,19.56 20.35,19.34 20.35,17.62 23.43,14.54 C3N02.1 | R3L11.2 68.98,28.58 J39.1
  Bottom 0.406: G302.VDD G302.PROG
FLIGHTPIN1M
  Route15 0.61: 51.55,65.88 51.55,64.95 50.93,64.33 50.93,62.83
  Route15 1.016: HCONM.B27 50.17,60.22 HCONM.B28 50.17,62.08 50.93,62.83 | FP31.2 89.55,53.35 91.02,54.82 91.02,72.41 87.13,76.3 71.65,76.3 70.23,77.72 68.77,77.72 68.77,77.7 55.93,77.7 50.44,72.21 50.44,66.92 51.48,65.88 51.55,65.88
FLIGHTPIN1P
  Top 0.61: 88.3,55.5 88.3,56.3 88.7,56.7
  Top 0.813: 88.3,55.5 88.3,55 87.9,54.6 86.6,54.6 84.4,52.4 84.4,50.37 85.1,49.67 D3A01.P$2 D3A02.P$2 D3A03.P$2 82.14,49.03 D3A04.P$2
  Top 1.016: 88.7,56.7 92.04,56.7 92.64,56.1 92.64,51.06 FP31.1
  Route15 1.016: HCONM.B25 47.63,60.22 HCONM.B26 47.63,62.53 47.02,63.15 45.46,63.15 44.78,63.83 44.78,66.4 45.51,67.13 45.51,80.59 46.56,81.64 58.61,81.64 60.34,79.91 72.55,79.91 74.27,81.63 77.84,81.63 81.36,78.11 87.7,78.11 92.64,73.17 92.64,53.94 92.09,53.39 FP31.1
FLIGHTPIN2P  (via drill 0.6)
  Route2 0.61: 50.5,62.4 52.04,60.86 HCONM.B30
  Route2 1.016: HCONM.B23 43.83,59.59 HCONM.B24 45.09,61.4 46.1,62.4 50.5,62.4
  Route15 0.61: 87.02,51.8 86.91,51.91 86.91,54.06 87.59,54.74 87.78,54.74
  Route15 0.813: 87.78,54.74 88.54,55.5 v89.5,55.5
  Route15 1.016: HCONM.B29 52.72,60.22 HCONM.B30 53.92,62.06 53.92,66.44 52.27,68.09 52.27,70.71 52.85,71.29 55.9,71.29 56.98,70.21 62.18,70.21 63.86,71.89 79.55,71.89 80.89,73.23 85.58,73.23 89.5,69.31 v89.5,55.5 | FP32.1 92.13,48 91.45,48.68 88.31,48.68 87.56,49.43 87.56,51.26 87.02,51.8
FLIGHTPIN3M  (via drill 0.6)
  Top 0.61: 87.9,41.4 88.1,41.2 90.8,41.2
  Top 0.813: v88.06,53.12 87.61,52.79 | D3A04.P$1 79.36,46.21 D3A03.P$1 D3A02.P$1 D3A01.P$1 85.14,46.16 87.61,46.16
  Top 1.016: 87.9,41.4 87.61,41.69 87.61,46.16 87.61,52.79 | 90.8,41.2 92.15,42.55 FP33.2
  Route2 0.813: 88.53,58.77 88.53,71.27 86.3,73.5 80.88,73.5 79.12,71.74 72.99,71.74 68.75,67.5 68.75,66.32 67.92,65.49 66.27,65.49 64.98,64.2 64.98,63.48 64.25,62.75 61.03,62.75 60.34,62.05 HCONM.B36
  Route2 1.016: 88.53,58.77 89.6,57.7 90.8,57.7 91.3,57.2 91.3,54.4 90,53.1 89.98,53.12 v88.06,53.12
  Route15 0.254: HCONM.B35 60.34,60.23 HCONM.B36
FLIGHTPIN3P
  Route15 0.254: HCONM.B33 56.52,59.6 HCONM.B34
  Route15 0.813: HCONM.B34 58.08,60.86 59.8,62.58 82.12,62.58 84.38,60.32 84.38,56.67 83.94,56.23 | 81.72,49.73 88.05,43.4 FP33.1
  Route15 1.016: 81.72,49.73 81.72,54.01 83.94,56.23
FM/CW_SWITCH
  Bottom 0.254: H801.36 24.55,43.06 24.87,43.38 31.18,43.38 35.26,47.46 35.26,49.51 40.02,54.27 HCONM.A20
FM_CLK
  Bottom 0.254: H801.33 23.05,43.63 24.15,44.73 30.35,44.73 33.55,47.93 33.55,50.23 37.47,54.15 HCONM.A18
FM_DAT
  Bottom 0.254: H801.32 22.55,44.08 23.95,45.48 29.79,45.48 32.92,48.61 32.92,50.82 36.2,54.1 HCONM.A17
FM_PTT
  Bottom 0.254: H801.34 23.55,43.18 24.48,44.11 30.95,44.11 34.59,47.75 34.59,49.98 38.75,54.13 HCONM.A19
FM_STB
  Bottom 0.254: H801.31 22.05,44.49 23.77,46.21 29.66,46.21 31.91,48.46 31.91,50.91 34.94,53.94 HCONM.A16
FMSWITCH  (via drill 0.7)
  Top 0.254: HCONM.B4 19.7,58.63 20.96,57.37 20.96,56.66 22.23,55.39 22.23,47.71 25.05,44.89 25.05,43.9 24.17,43.02 v24.17,39.64
  Bottom 0.254: H801.37 25.05,40.52 v24.17,39.64
FX_CLK(RX)
  Bottom 0.254: H801.21 14.22,38.16 12.51,39.87 12.51,45.76 12.86,46.11 16.39,46.11 18.25,47.97 18.25,50.56 22.23,54.55 HCONM.A6
FX_CLK(TX)
  Bottom 0.254: H801.28 20.55,45.9 22.95,48.3 28.42,48.3 29.67,49.55 29.67,51.81 31.12,53.27 HCONM.A13
FX_DET(RX)
  Bottom 0.254: H801.24 16.42,39.66 16.24,39.84 16.24,40.36 18.27,42.39 18.27,46.21 19.5,47.44 19.5,50.11 22.57,53.18 23.59,53.18 24.77,54.37 HCONM.A8
FX_M0(RX)
  Bottom 0.254: H801.25 18.92,41.53 18.92,46.1 20.12,47.3 20.12,49.76 22.65,52.29 23.63,52.29 26.05,54.7 HCONM.A9
FX_M1(TX)
  Bottom 0.254: H801.30 21.55,45 23.42,46.87 29.12,46.87 31.15,48.9 31.15,51.24 33.59,53.67 33.66,53.67 HCONM.A15
FX_RDYN
  Bottom 0.254: H801.27 20.05,46.07 23.05,49.06 28.4,49.06 28.96,49.62 28.96,53.23 29.86,54.12 HCONM.A12
FX_RDYN(RX)  (via drill 0.6)
  Top 0.254: HCONM.A11 28.59,53.87 28.17,53.45 26.76,53.45 25.79,52.48 25.79,40.69 v26.02,40.46
  Bottom 0.254: H801.38 25.55,40.93 v26.02,40.46
FX_RXD(RX)
  Bottom 0.254: H801.23 15.91,39.16 15.5,39.57 15.5,40.55 17.61,42.66 17.61,46.28 18.9,47.57 18.9,50.35 22.36,53.81 22.88,53.81 23.5,54.44 HCONM.A7
FX_TXD(TX)
  Bottom 0.254: H801.29 21.05,45.48 23.15,47.58 28.77,47.58 30.36,49.17 30.36,51.64 32.19,53.47 32.39,53.47 HCONM.A14
GND  (via drill 0.3, 0.6, 0.7)  (2 unrouted)
  Top 0.254: R3L04.2 76.96,19.74 77,19.78 77,20.5 | R3L04.2 C3L05.2 | 57,34.95 55.69,33.64 55.69,31.07 57.4,29.36 ERM20.7 | ERM16.1 ERM16.2 54.67,29.82 54.98,30.13 54.98,31.97 54.59,32.36 | 54.72,42.64 ERM13.4 | 54.72,42.64 54.98,42.9 54.98,47.48 54.68,47.78 ERM14.4 52.67,47.78 50.11,45.22 46.35,45.22 ERM14.7 44.62,45.24 43.68,44.3 43.68,41.09 44.82,39.95 | 54.72,42.64 54.98,42.38 54.98,39.56 | 54.98,35.6 54.98,37.07 54.55,37.5 ERM15.4 ERM13.1 54.25,38.83 54.98,39.56 | 54.98,35.6 54.34,34.96 | 54.34,34.96 ERM15.2 | 54.59,32.36 ERM16.4 | 54.59,32.36 54.98,32.75 54.98,34.32 54.34,34.96 | 33.29,6.66 33.29,13.17 31.55,14.91 v27.43,14.91 | 33.29,6.66 IC313.4 | 42.02,24.45 C3O05.2 v40.06,24.9 | 43.3,21.66 IC305.4 | R3D02.1 56.11,82.25 56.8,82.94 58.52,82.94 59.11,82.35 C3D02.2 | IC314.4 58.77,81.49 C3D02.2 | 61.08,14.38 IC301.4 61.5,14.8 C3K02.2 61.33,15.91 61.33,16.59 61.07,16.85 59.19,16.85 R3K02.1 57.94,16.16 57.94,16.89 57.78,17.05 57.6,17.05 | MPX33.GND2 41.09,69.96 42.14,68.91 C3Q01.1 42.14,65.38 44.17,63.35 45.81,63.35 46.06,63.6 46.06,64.12 TMP301.3 46.72,63.36 47.38,62.7 48.63,62.7 C3J01.2 | MPX32.GND2 30.11,21.23 31.08,22.2 | 31.08,22.2 C3R01.1 | 56.43,17.07 C3K01.2 57.58,17.07 57.6,17.05 | v12.62,60.16 12.62,60.75 16.51,64.64 v19.6,64.64 | v55.7,68.05 56.35,68.05 59.82,64.58 TMP302.GND 60.34,64.01 | 10.1,68.56 10.1,75.75 12.5,78.15 IC306.7 | v10.1,65.94 10.1,68.56 | IC306.7 arc45 14.09,78.18 | v40.06,24.9 43.3,21.66 | v48.98,14.54 48.98,13.55 47.91,12.48 v47.28,12.48 | v83.63,28.31 83.63,28.33 82.88,29.08 79.38,29.08 78.4,28.1 78.4,26.78 C3L07.2 78.43,25.93 78.1,25.6 74.18,25.6 MAG301.GND
  Top 0.254: MPX33.GND1 47.17,76.47 47.6,76.89 v47.6,79.72 | v84.76,24.65 86.34,26.23 86.34,26.24 86.54,26.44 86.54,30.33 85.14,31.73 77.73,31.73 | 68.51,43.27 68.51,46.16 66.9,47.77 66.78,47.77 66.77,47.77 ERM18.4 61.84,47.77 61.41,47.34 61.41,45.97 60.67,45.23 ERM18.7 | MPX32.GND1 23.55,25.91 v23.55,23.96 25.31,22.2 31.08,22.2 | ERM18.7 57.16,45.23 55.79,43.86 55.79,41.44 57.14,40.09 | 57,34.95 55.63,34.95 54.98,35.6 | 57.14,40.09 55.51,40.09 54.98,39.56 | C3A05.2 76.22,33.24 77.73,31.73 | IC306.7 | HCONM.A1 15.88,55.79 HCONM.A2 15.88,58.33 HCONM.B1 15.88,59.6 HCONM.B2 | v47.6,79.72 47.6,80.61 48.59,81.6 C3D01.2 | v47.6,79.72 47.6,83.8 48.77,84.97 51.81,84.97 v52.27,84.51 | v14.03,49.13 15.63,47.52 15.63,40.85 v14.53,39.75 | IC302.4 14.75,11.74 v19.02,11.74 20.11,10.65 20.11,9.48 21.3,8.29 R3N04.2 | 54.3,26.78 53.95,26.78 54.71,26.02 C3P01.2 54.71,21.73 53.38,20.39 UA2.GND UA2.GNDS 53.01,18.54 C3P03.2 52.65,16.35 C3P02.2 51.37,16.31 | 54.3,26.78 56.38,26.78 | 56.38,26.78 57.78,25.38 57.78,17.23 57.6,17.05 | v79.41,68.24 80.27,68.24 81.27,69.24 | 81.27,69.24 v81.73,69.7 81.73,74.36 77.11,78.98 v74.68,78.98 74.68,82.42 73.8,83.3 v73.03,83.3 72.73,83 72.73,78.48 72.66,78.48 72.66,77.95 v72.72,77.89 | v12.83,69.45 10.99,69.45 10.1,68.56 | 56.38,26.78 64.19,26.78 65.5,28.09 ERM20.1 ERM20.2 67.16,29.36 67.5,29.7 67.5,31.33 67.1,31.73 | 57.14,40.09 57.3,39.93 ERM17.7 | 57,34.95 57.3,34.65 ERM19.7 | 68.51,43.27 67.71,42.47 ERM17.4 | ERM19.4 67.16,37.19 67.44,36.91 67.44,34.91 67.18,34.65 ERM19.2 | 68.51,43.27 68.61,43.17 | ERM18.7 | 44.82,39.95 ERM13.7 | 44.82,39.95 44.52,39.95 43.8,39.23 43.8,39 43.77,38.98 43.77,35.88 44.2,35.45 v44.61,35.45 44.45,35.29 44.45,34.72
  Top 0.254: 44.45,34.72 ERM15.7 | ERM16.7 45.25,29.5 43.68,31.07 43.68,33.95 44.45,34.72 | IC322.4 71.69,16.71 71.7,16.7 | C3L09.2 70.64,18.24 IC322.4 | 78.35,21.95 77,20.6 77,20.5 | 78.35,21.95 77.7,22.6 v77.7,23.9 | R3L04.2 76.96,18.74 78,17.7 78,17.2 78.1,17.1 78.1,16.9 78.9,16.1 80.4,16.1 80.6,15.9 v80.6,14.2 | v75.9,20.8 76.7,20.8 77,20.5 | 67.1,31.73 66.13,31.73 ERM20.4 | 67.1,31.73 77.73,31.73 | R3A13.1 17.98,84.52 18.7,83.8 18.7,82.77 v18.65,82.72 R3A14.1 20.43,84.64 R3A17.2 | C3A04.2 41.6,40.82 41.6,38.4 42.39,37.61 v42.39,36.96 42.39,35.3 | 42.39,35.3 42.39,34.72 42.26,34.59 42.26,33.66 | v40.06,24.9 40.06,31.46 42.26,33.66 | C3A02.2 38.4,33.9 40,35.5 42.19,35.5 42.39,35.3 | C3A02.2 C3A03.2 | 78.35,21.95 C3L04.2 | 42.26,33.66 42.26,29.54 44.5,27.3 44.5,26.9 44.6,26.8 54.28,26.8 54.3,26.78 | v43,19.7 43,21.37 43.3,21.66 | 33.29,6.66 34.25,6.66 34.71,6.19 34.71,5.48 v34.84,5.35 | C3J02.2 48.32,68.4 v48.15,68.4 | R3J03.1 59.37,62.91 60.34,63.88 60.34,64.01 | 70.73,63.69 69.15,62.11 66.11,62.11 65.84,62.38 R3I03.1 61.13,63.22 60.34,64.01 | 70.73,63.69 TMP303.3 | 70.73,63.69 71.82,62.6 C3H01.2 | 81.27,69.24 81.27,65.75 v83.92,63.1 | C3A02.2 38.43,34.3 | v70.26,15.36 71.38,15.36 71.69,15.66 IC322.4 | C3D02.2 59.11,83.8 v59.17,83.86 61.02,85.71 62.35,85.71 62.6,85.45 IC304.4
  Top 0.406: C3R01.1 29.8,22.2 v28.75,23.25 | 68.61,43.17 68.87,42.91 68.87,40.45 67.08,38.66 ERM17.1 ERM19.4
  Route2 0.254: TMP303.3 70.73,67.44 71.63,68.34 79.31,68.34 v79.41,68.24 | v48.98,14.54 43.82,19.7 v43,19.7 | v18.65,82.72 21.23,82.72 23.83,80.12 23.83,74.48 TMP305.3 TMP306.3 | TMP306.3 | TMP306.3 TMP304.3 | TMP304.3 44.92,79.72 v47.6,79.72 | TMP304.3 34.87,70.5 34.04,69.67 34.04,66.63 34.69,65.98 36.86,65.98 38.63,67.75 44.68,67.75 46.72,65.71 TMP301.3
  Route15 0.254: JP304.15 84.98,22.06 84.14,22.9 84.14,24.03 v84.76,24.65 | 60.23,66.41 60.23,64.69 TMP302.GND
  Route15 0.61: 87.28,46.91 84.64,49.55 84.64,52.09 85.99,53.44 85.99,55.68 | 60.23,66.41 59.49,65.67 57.41,65.67 56.17,64.43 56.17,62.94
  Route15 1.016: HCONM.B31 53.98,59.59 HCONM.B32 55.26,62.02 56.17,62.94 | 87.28,46.91 FP32.2 | 85.99,55.68 85.8,55.87 85.8,57.9 86.5,58.6 87.4,58.6 88.01,59.21 88.01,66.01 87.62,66.4 60.24,66.4 60.23,66.41
  Bottom 0.254: C3H03.2 | C3H02.2 73.11,67.78 C3H03.2 | C3G02.2 80.66,79.7 C3G03.2 78.65,78.35 77.56,79.44 | 77.56,79.44 IC315.4 | 77.56,79.44 77.11,78.98 v74.68,78.98 | R3L08.1 83.63,30.32 v83.63,28.31 83.65,28.31 84.76,27.2 v84.76,24.65 | R3L12.1 67.22,17.8 67.58,17.44 R3L10.1 68.6,17.44 70.23,19.07 C3L11.2 | C3N01.2 C3N06.2 | C3N06.2 25.75,10.3 | C3N06.2 25.75,10.01 25.99,10.01 26.6,9.4 28.22,9.4 G302.MODE_SEL | C3N03.2 27.1,13.36 C3N01.2 | C3O06.2 C3O03.2 36.85,20.4 34.5,20.4 32.96,21.94 C3A07.2 29.78,15.71 C3N03.2 | R3O04.2 47.41,14.94 C3O01.2 | 76.15,66.85 76.15,66.25 IC316.4 76.17,67.15 | 76.17,67.15 76.17,67.84 75.55,68.45 75.12,68.45 C3H03.2 | 76.17,67.15 76.77,67.75 78.92,67.75 v79.41,68.24 | H801.44 28.55,40.76 28.16,40.37 27.29,40.37 26.69,39.77 26.69,37.91 26.05,37.27 26.05,36 arc45 26.12,35.83 28.39,33.56 | R3A05.2 13.98,28.14 C3A01.2 15.37,27.07 15.99,27.07 16.38,26.68 16.38,25.5 16.01,25.13 15.41,25.13 R3A04.2 | 23.55,27.38 23.55,31.24 24.8,32.49 25.8,32.49 | 23.55,27.38 H801.92 v23.55,23.96 23.55,23.45 C3A06.2 | H801.57 | 18.91,37.4 18.91,38.37 18.62,38.66 H801.22 15.61,38.67 v14.53,39.75 | 18.91,37.4 18.91,33.47 18.6,33.16 H801.11 8.53,33.16 7.92,32.55 7.92,30.52 10.23,28.21 10.23,24.41 10.56,24.08 11.94,24.08 R3A04.2 | H801.86 26.55,27.2 26.13,27.62 23.79,27.62 23.55,27.38 | R3A04.2 R3M04.2 | C3E02.2 56.9,80.32 | 53.95,80.3 53.95,79.55 54.8,78.7 C3E03.2 56.6,78.7 57.23,79.33 C3E02.2 | 53.95,80.3 IC303.4 | 53.95,80.3 53.35,79.7 v47.6,79.72 | 25.8,32.49 23.34,34.95 23.34,37.46 22.4,38.4 19.91,38.4 18.91,37.4 | v81.73,69.7 v84.5,69.7 | v55.7,68.05 55.24,67.59 53.21,67.59 52.67,67.05
  Bottom 0.254: 52.67,67.05 52.67,67.67 51.47,68.87 C3J03.2 48.62,68.87 v48.15,68.4 46.72,66.97 TMP301.3 | 52.67,67.05 IC318.4 | v19.6,64.64 11.5,64.64 arc-45 11.33,64.71 v10.1,65.94 | C3N03.2 v27.43,14.91 | 28.39,33.56 28.39,34.25 | 28.39,34.25 28.39,36.29 29.26,37.16 H801.57 | 25.8,32.49 27.9,32.49 28.39,32.98 28.39,33.56 | H801.65 31.95,33.16 31.34,32.55 30.08,32.55 28.39,34.25 | v48.98,14.54 48.98,15.97 C3O01.2 | v18.65,82.72 18.65,75.27 v12.83,69.45 | HCONM.A1 15.88,53.26 v14.03,49.13 | v19.02,11.74 18.55,11.74 C3M05.2 16.24,9.98 14.59,11.63 G301.VSS | C3N01.2 C3N02.2 | C3O01.2 C3M02.2 48.15,18.83 G303.VSS | v72.72,77.89 72.72,76.45 C3F02.2 | v44.61,35.45 43.1,36.96 v42.39,36.96 42.39,37.61 41.79,38.21 39.86,38.21 38.81,37.16 H801.57 | MAG301.GND 75.28,24.5 77.1,24.5 v77.7,23.9 | MAG301.GND 74.18,25.6 | v80.6,14.2 80.6,16.51 R3L03.2 | C3L11.2 75.12,19.12 75.8,19.8 75.8,20.7 v75.9,20.8 | IC321.4 70.23,20.59 C3L11.2 | IC323.4 80.08,28.89 80.08,26.48 79.2,25.6 74.2,25.6 MAG301.GND | G303.MODE_SEL 43.92,20.22 43.4,19.7 v43,19.7 | v47.28,12.48 46.7,11.9 44.57,11.9 C3O04.2 | C3N05.2 32.17,9.55 G302.VSS | v19.02,11.74 19.23,11.74 19.71,12.22 19.71,16.17 | C3N05.2 | C3N05.2 34.66,9.58 36.84,9.58 37.42,9 C3N04.2 37.4,7.5 37.4,6.57 36.89,6.06 35.81,6.06 35.1,5.35 v34.84,5.35 | C3M03.2 | C3M03.2 18.62,16.62 | 19.71,16.17 19.71,19.58 19.3,19.99 17.5,19.99 17.17,20.32 17.17,21.05 C3M01.2 17.11,20.99 C3M06.2 15.52,20.53 14.6,19.61 G301.MODE_SEL | C3M04.2 19.02,12.76 v19.02,11.74 | C3M03.2 19.15,16.73 19.71,16.17 | R3G03.1 71.89,84.44 v73.03,83.3 | IC317.4 64.53,67.56 64.18,67.92 64.02,67.92 C3I03.2 62.67,69.16 61.67,70.16 59.33,70.16 59.08,69.91 C3I02.2 59.08,68.57 59.42,68.23 59.42,66.86 60.04,66.24 60.04,64.88 TMP302.GND 60.34,62.84 60.21,62.71 C3I01.2
  Bottom 0.254: R3H03.1 81.84,63.1 v83.92,63.1 | C3L11.2 70.66,18.69 70.66,15.76 v70.26,15.36 | v52.27,84.51 52.27,85.56 R3E03.1 | C3E02.2 59.17,82.34 v59.17,83.86 | C3E01.2 27.82,72.89 TMP305.3 | C3G01.2 32.52,71.28 TMP306.3 | C3F01.2 37.37,72.19 37.37,71.12 36.75,70.5 TMP304.3
  Bottom 0.406: C3M01.2 17.19,21.77 C3O02.2 16.09,22.88 15.55,23.43 15.55,24.99 15.41,25.13 | v12.62,60.16 15.88,60.16 HCONM.B1 | v28.75,23.25 29.5,23.25 29.75,23 29.75,21.97 C3A07.2
  pour Bottom (no thermals): 0,89 0,5 15,5 15,0 78,0 78,5 94,5 94,89 arc90 93,90 1,90 arc90
  pour Top (no thermals): 0,89 0,5 15,5 15,0 78,0 78,5 94,5 94,89 arc90 93,90 1,90 arc90
  pour Route15 (isolate 0.254, no thermals): 0,89 0,5 15,5 15,0 78,0 78,5 94,5 94,89 arc90 93,90 1,90 arc90
MAIN_DEBUG_RX  (via drill 0.6)
  Top 0.254: HCONM.A32 55.25,57.05 54.45,57.05 53.31,55.91 52.33,55.91 51.44,56.79 51.44,57.48 50.2,58.72 50.2,59.19 49.34,60.04 48.39,60.04 48.04,59.69 47.16,59.69 46.4,60.45 46.4,61.58 45.99,61.99 43.56,61.99 41.77,63.78 v41.77,63.97
  Route2 0.254: HCONM.A32 55.3,57.01 55.3,51.9 58.5,48.7 63.1,48.7 64,47.8 65.1,47.8 65.7,48.4 65.7,49 66.8,50.1 71.3,50.1 73.6,47.8 76,47.8 76,47.9 78.3,50.2 81.3,50.2 83.3,48.2 84,48.2 86,46.2 86,40.1 86.9,39.2 86.9,37.6 88.4,36.1 90.9,36.1 JP304.6
  Bottom 0.254: HCONM.A32 56.2,57.06 57.54,55.72 57.96,55.72 58.74,56.5 59.29,56.5 60.19,55.6 60.19,54.36 61.81,52.73 R3A03.1 | 17.49,35.1 H801.15 11.24,35.16 9.36,37.04 9.36,42.77 v8.87,43.26 9.36,43.75 9.36,59.52 12.77,62.92 34.81,62.92 35.86,63.97 v41.77,63.97
MAIN_DEBUG_TX  (via drill 0.7)
  Top 0.254: HCONM.A30 53.69,57.06 54.68,58.05 55.97,58.05 56.59,57.43 56.59,56.68 57.58,55.69 57.99,55.69 58.78,56.48 58.78,56.51 59.28,56.51 60.31,55.48 60.31,53.65 63.19,50.77 72.79,50.77 v73.27,50.29 | 87.61,36.2 87.61,18.85 79.2,10.44 79.2,7.6 75.1,3.5 59.4,3.5 58.89,2.99 58.89,2.94 57.75,1.8 39.02,1.8 38.59,1.37 19.13,1.37 v18.36,2.14 | 87.61,36.2 87.61,39.47 | JP304.5 89.05,34.76 87.61,36.2
  Top 0.406: v73.23,39.85 75.18,37.9 82.8,37.9 84.8,39.9 87.18,39.9 87.61,39.47
  Route2 0.254: v18.36,2.14 18.36,5.63 17.84,6.15 17.84,27.27 16.4,28.71 13.84,28.71 12.45,30.1 12.45,31.24 v8.41,35.28
  Bottom 0.254: H801.13 9.54,34.15 v8.41,35.28 | v73.23,39.85 74.12,40.74 74.12,49.44 v73.27,50.29
MAIN_MISSION_MEM_SCL  (via drill 0.6, 0.7)
  Top 0.254: v32.9,43.46 32.9,51.62 35.15,53.87 44.37,53.87 45.1,54.6 45.1,55.56 45.8,56.26 46.9,56.26 47.3,55.86 48.1,55.86 48.5,56.26 49.4,56.26 50.1,55.56 50.1,53.74 53.04,50.8 55.27,50.8 56.7,49.38 67.6,49.38 71.88,45.1 73.73,45.1 76.7,48.07 78.32,48.07 78.8,47.59 79.93,47.59 79.93,47.56 80.32,47.17 81.15,47.17 81.52,47.54 85.9,47.54 86.38,48.02 86.38,50.24 v85.81,50.81
  Top 0.406: v85.81,50.81 85.8,50.8
  Route2 0.254: HCONM.B46 73.03,61.38 73.55,61.9 85.11,61.9 v86.54,60.47
  Bottom 0.254: H801.51 33.55,41.68 32.97,42.26 arc-45 32.9,42.44 v32.9,43.46 | 88.32,59.5 87.35,60.47 v86.54,60.47
  Bottom 0.406: 88.32,59.5 88.35,59.47 88.35,54.71 87.85,54.21 86.48,54.21 85.81,53.54 v85.81,50.81
MAIN_MISSION_MEM_SDA
  Bottom 0.254: H801.52 34.76,39.66 36.15,41.05 36.15,49.37 40.39,53.61 41.73,53.61 42.63,54.51 42.63,55.62 43.89,56.88 43.89,57.41 45.21,58.73 45.15,58.79 45.15,59.4 45.73,59.98 47.06,59.98 47.39,59.65 48.09,59.65 48.55,60.11 49.28,60.11 49.99,59.4 50.32,59.4 51.04,60.12 51.89,60.12 52.37,59.64 53.08,59.64 53.66,60.22 54.37,60.22 55.11,59.48 55.48,59.48 56.26,60.26 56.87,60.26 57.64,59.49 58,59.49 58.66,60.15 59.47,60.15 60.03,59.59 60.59,59.59 61.26,60.26 61.89,60.26 62.68,59.47 63.07,59.47 63.83,60.23 64.42,60.23 65.16,59.49 65.68,59.49 66.33,60.14 67.05,60.14 67.65,59.54 68.28,59.54 68.8,60.06 69.78,60.06 70.88,58.96 HCONM.B45
MAIN_MISSION_MEM_SW  (via drill 0.7)
  Top 0.254: v78.64,43.31 v78.63,43.3 75.2,43.3 74.82,43.69 70.88,43.69 69.1,45.46 69.1,46.47 67.11,48.46 56.15,48.46 54.82,49.79 v49.18,49.79
  Bottom 0.254: H801.55 37.72,38.16 38.69,39.13 41.82,39.13 43.3,40.61 43.3,48.1 43.54,48.34 45.09,48.34 45.36,48.07 46.66,48.07 48.38,49.79 v49.18,49.79 | HCONM.A50 79.02,56.15 79.02,43.69 v78.64,43.31
MAIN_MISSION_RX  (via drill 0.7)
  Top 0.254: v14.59,31.66 10.41,31.66 3.15,24.39 3.15,15.51 9.24,9.42 12.34,9.42 12.89,9.97 14.65,9.97 14.66,9.98 22.2,2.44 37.36,2.44 40.66,5.75 52.88,5.75 54.37,4.26 74.7,4.26 78.3,7.86 78.3,10.2 87.05,18.95 87.05,35.84 v84.97,37.91
  Bottom 0.254: HCONM.B49 78,58.96 78.51,58.96 80.2,60.65 82.91,60.65 83.58,59.97 83.58,59.23 R3A01.1 84.56,57.28 82.1,54.82 82.1,49.9 82.93,49.06 82.93,39.96 v84.97,37.91 | H801.9 15.09,32.16 v14.59,31.66
MAIN_MISSION_TX  (via drill 0.6, 0.7)
  Top 0.254: HCONM.B47 73.39,58.96 72.19,60.16 71.41,60.16 70.81,59.56 70.28,59.56 69.77,60.07 68.8,60.07 68.27,59.54 67.65,59.54 67.05,60.14 66.33,60.14 65.68,59.49 65.16,59.49 64.41,60.24 63.84,60.24 63.07,59.47 62.68,59.47 61.89,60.26 61.26,60.26 60.59,59.59 60.03,59.59 59.47,60.15 58.66,60.15 58,59.49 57.64,59.49 56.86,60.27 56.27,60.27 55.48,59.48 55.11,59.48 54.35,60.24 54.11,60.24 53.91,60.44 53.91,61.41 52.92,62.4 v52.28,62.4 | v19.9,34.85 18.55,36.2 15.56,36.2 13.56,38.2 13.56,40.5 15.04,41.98 15.04,46.3 v12.02,49.32
  Bottom 0.254: v19.9,34.85 19.9,33.55 19.11,32.76 19.11,31.98 18.79,31.66 H801.8 | v12.02,49.32 12.02,53.53 16.71,58.22 17.59,58.22 18.09,57.72 18.84,57.72 19.34,58.22 20.11,58.22 20.53,57.8 21.36,57.8 21.91,58.35 22.52,58.35 23.13,57.74 23.92,57.74 24.45,58.27 25.19,58.27 25.63,57.83 26.47,57.83 27.3,58.66 27.3,59.38 27.93,60.01 28.18,60.01 28.59,60.42 28.59,61.83 29.04,62.28 37.53,62.28 38.77,63.52 40.59,63.52 41.56,62.55 52.13,62.55 v52.28,62.4 52.16,62.28
MAIN_POWER_RX  (via drill 0.6)
  Route2 0.254: JP304.2 92.3,39.9 92.3,41.1 92.2,41.2 88.9,41.2 87.9,42.2 87.9,50.2 87.88,50.2 85.8,52.28 85.8,58.86 83.79,60.87 HCONM.B50 77.48,60.22 76.59,60.22 76.11,59.74 75.13,59.74 74.85,60.02 73.75,60.02 73.25,59.52 72.79,59.52 72.15,60.16 71.39,60.16 70.79,59.56 70.29,59.56 69.72,60.13 68.83,60.13 68.24,59.54 67.65,59.54 67.04,60.15 66.3,60.15 65.71,59.56 65.13,59.56 64.53,60.16 63.79,60.16 63.24,59.61 62.64,59.61 61.99,60.26 61.38,60.26 60.71,59.59 60.08,59.59 59.54,60.13 58.69,60.13 57.95,59.39 57.64,59.39 56.8,60.23 56.17,60.23 55.53,59.59 55.08,59.59 54,60.67 54,61 | v8.4,37.1 5,40.5 5,43.6 6.9,45.5 6.9,59.9 10.61,63.61 18.97,63.61 19.23,63.35 40.43,63.35
  Route2 0.406: 54,61 54,63.8 53,64.8 51.3,64.8 50,63.5 43.9,63.5 43.3,62.9 40.88,62.9 40.43,63.35
  Bottom 0.254: R3A02.1 78.87,61.62 HCONM.B50 | v8.4,37.1 10.84,34.66 H801.14
MAIN_POWER_TX  (via drill 0.7)
  Top 0.254: HCONM.B48 76.48,60.87 77.5,59.85 79.86,59.85 80.29,60.28 83.33,60.28 84.54,59.07 v84.54,54.58 | v42.95,80.17 48.7,85.9 56.24,85.9 57.34,87 79.68,87 80.78,85.9 81.87,84.83 81.87,75.8 82.53,75.14 82.53,70.81 82.91,70.43 82.91,66.08 86.94,62.05 87.93,62.05 88.92,61.06 88.92,59.53 88.3,58.91
  Top 0.406: 88.3,58.91 87.2,57.81 v87.2,56.14
  Bottom 0.254: H801.12 8.6,33.66 7.4,34.86 7.4,61.39 9.48,63.47 34.08,63.47 42.95,72.34 v42.95,80.17 | v84.54,54.58 84.5,54.54 84.5,50.1 85.3,49.3 85.3,43.3 88.3,40.3 88.3,38.7 JP304.3
  Bottom 0.406: v84.54,54.58 86.1,56.14 v87.2,56.14
MAINALIVE  (via drill 0.6, 0.7)
  Top 0.254: v19.88,29.55 22.08,29.54 24.01,31.46 24.01,37.26 27.3,40.55 v27.3,50.84 | HCONM.A26 46.61,57.06 46.61,57.34 45.83,58.12 45.27,58.12 45.04,58.35 45.04,59.26 44.24,60.06 43.28,60.06 42.73,59.51 42.39,59.51 41.86,60.04 41.68,60.04 41.41,60.31 41.41,61.73 40.7,62.44 v39.74,62.44
  Bottom 0.254: H801.96 21.55,27.88 v19.88,29.55 | v39.74,62.44 38.69,61.39 38.69,60.56 38.02,59.89 36.94,59.89 36.6,60.23 35.8,60.23 35.28,59.71 34.46,59.71 34.04,60.13 33.19,60.13 32.82,59.76 31.87,59.76 31.45,60.18 30.75,60.18 29.69,59.12 29.69,58.55 28.59,57.45 28.59,56.79 27.3,55.5 v27.3,50.84
MAINMODE1_VCC  (via drill 0.6, 0.7)
  Top 0.254: v30.76,33.67 30.76,31.31 29.9,30.45 28.15,30.45 27,29.3 27,29.1 25.4,27.5 16.65,27.5 v15.24,26.09 | v56.75,3.12 39.19,3.12 37.97,1.9 21.67,1.9 18.8,4.77 v17.15,4.77
  Route2 0.254: v17.15,4.77 17.15,12.01 12.5,16.66 12.5,24.58 13.98,26.06 15.21,26.06 v15.24,26.09 14.83,26.09
  Bottom 0.254: R3A05.1 R3A04.1 | R3A10.1 12.64,28.5 R3A05.1 | R3A05.1 arc45 11.33,27.05 12.28,26.1 15.22,26.1 arc-45 v15.24,26.09 | H801.64 30.78,33.66 arc-45 v30.76,33.67 | H801.10 9.85,32.66 v9.15,31.96 9.15,30.21 11.29,28.07 R3A05.1 | v56.75,3.12 72.7,3.12 | 72.7,3.12 72.95,3.12 | HCONM.A48 75.58,37.92 76.6,36.9 85.9,36.9 | 85.9,36.9 86.5,37.5 86.5,38.9 | 85.9,36.9 86.3,36.9 87.6,35.6 87.6,25.1 | 87.6,25.1 87.6,18.02 72.7,3.12 | JP304.13 88.1,24.6 87.6,25.1
MAINMODE2_GND  (via drill 0.3, 0.6)
  Route2 0.254: JP304.14 90.94,23.3 88.5,23.3 86.7,25.1 86.7,35.3 85.1,36.9 84.1,36.9 80.8,40.2 | 80.8,40.2 v80.8,48 | 80.8,40.2 78.5,37.9 71,37.9 70.2,37.1 60.5,37.1 59,35.6 51,35.6 49.6,34.2 49.4,34.2 48.4,35.2 47,35.2 45.7,33.9 43.5,33.9 39.8,30.2 38.6,30.2 34.5,26.1 v34.5,23.9
  Bottom 0.254: R3A06.1 33.55,27.34 H801.75 34.44,28.16 35.1,27.5 35.1,24.1 34.9,23.9 v34.5,23.9 | HCONM.A46 73.64,57.66 74.6,57.66 75.2,58.26 75.9,58.26 76.5,57.66 77.1,57.66 77.6,58.16 79,58.16 79.7,57.46 79.7,49.1 v80.8,48
MPX0-S1B  (via drill 0.7)
  Top 0.254: MPX33.S1B 48.3,75.81 v48.89,76.41
  Bottom 0.254: IC303.6 52.69,75.19 52.3,74.8 49.3,74.8 48.89,75.21 v48.89,76.41
MPX0-S2B  (via drill 0.6, 0.7)
  Top 0.254: MPX33.S2B 50.69,75.17 53.4,72.45 57.8,72.45 58.75,73.4 v59.35,73.4 | v63.87,81.37 IC304.6
  Bottom 0.254: v59.35,73.4 60.55,74.6 60.55,80.38 61.57,81.4 63.84,81.4 v63.87,81.37
MPX0-S3B  (via drill 0.3)
  Top 0.254: MPX33.S3B 48.84,74.52 49.05,74.3 50.2,74.3 53.65,70.85 56.97,70.85 58.01,71.89 v59.38,71.89
  Bottom 0.254: IC315.6 76.35,75.92 76.35,74.75 74.25,72.65 70.35,72.65 69.15,73.85 66.85,73.85 66.35,74.35 63.55,74.35 62.35,73.15 61.31,73.15 60.97,72.81 60.3,72.81 v59.38,71.89
MPX0-S4B  (via drill 0.7)
  Top 0.254: MPX33.S4B 48.13,73.86 48.67,73.33 v49.38,73.33
  Bottom 0.254: IC316.6 77.44,72.47 76.75,73.15 75.65,73.15 74.45,71.95 70.05,71.95 68.85,73.15 66.55,73.15 66.05,73.65 63.85,73.65 62.65,72.45 61.58,72.45 60.3,71.17 58.56,71.17 58.35,71.38 58.35,72.95 57.2,74.1 51.2,74.1 50.43,73.33 v49.38,73.33
MPX0-S5B  (via drill 0.7)
  Top 0.254: MPX33.S5B 47.48,73.22 v48.56,72.13
  Bottom 0.254: v48.56,72.13 49.44,72.13 49.66,72.35 50.75,72.35 51.8,73.4 56.9,73.4 57.7,72.6 57.7,71.04 58.09,70.65 60.74,70.65 61.99,71.9 62.92,71.9 63.97,72.95 65.19,72.95 65.8,72.34 IC317.6
MPX0-S6B  (via drill 0.7)
  Top 0.254: MPX33.S6B 46.98,72.56 47.6,71.95 47.6,71.2 48.15,70.65 v49.01,70.65
  Bottom 0.254: IC318.6 53.94,72.36 53.7,72.7 52,72.7 51.75,72.35 51.75,72.05 51.35,71.65 50.05,71.65 49.05,70.65 v49.01,70.65
MPX1-S1A
  Top 0.254: IC302.6 17.19,17.16 19.88,14.47 21.44,14.47 24.91,17.95 MPX32.S1A
MPX1-S2A
  Top 0.254: IC313.6 30.84,12.3 29.94,13.2 26.82,13.2 25.57,14.46 MPX32.S2A
MPX1-S3A
  Top 0.254: IC305.6 39.1,20.39 34.66,15.95 27.06,15.95 26.21,16.8 MPX32.S3A
MPX1-S4A  (via drill 0.7)
  Top 0.254: v21.6,18.4 20.55,18.4 19.35,19.6 19.35,24.48 18.19,25.64 16.39,25.64 15.88,25.13 14.11,25.13 11.98,27.26 v9.33,27.26 | MPX32.S4A 26.86,17.84 v27.31,17.39 | v41.04,4.25 v49.32,4.25
  Bottom 0.254: 21.99,2.93 21.99,2.91 | 21.99,2.93 16.91,8.01 16.03,8.01 15.56,7.54 15.56,6.82 14.78,6.04 11.63,6.04 10.71,6.96 10.71,8.01 4.95,13.77 4.95,19.37 7.44,21.86 7.44,25.42 9.28,27.26 v9.33,27.26 | v49.32,4.25 59.41,4.25 67.84,12.68 arc-45 v67.87,12.69 65.91,12.69 64.04,14.56 64.04,17.06 63.7,17.4 61.2,17.4 60.7,17.9 60.7,21 62.3,22.6 62.9,22.6 63.48,22.02 IC321.6 | v27.31,17.39 22.61,17.39 v21.6,18.4 | 21.99,2.93 23.12,1.8 38.59,1.8 v41.04,4.25
MPX1-S5A  (via drill 0.7)
  Top 0.254: MPX32.S5A 27.52,18.71 28.34,17.89 33.55,17.89 v34.7,19.04 | v36.64,12.86 38.93,10.57 48.25,10.57 49,9.82 52.79,9.82 53.8,8.81 54.42,8.81 56.41,6.82 73.52,6.82 73.8,7.1 73.8,9.3 72.95,10.14 IC322.6
  Bottom 0.254: v34.7,19.04 34.7,14.91 arc45 34.77,14.73 v36.64,12.86
MPX1-S6A  (via drill 0.3, 0.6, 0.7)
  Top 0.254: MPX32.S6A 28.16,19.09 28.64,18.61 32.62,18.61 32.62,20.22 32.8,20.4 33.4,20.4 34.27,21.27 34.27,22.57 34.6,22.9 34.8,22.9 35.5,23.6 35.5,24.9 36.9,26.3 38.56,26.3 39.32,27.06 39.32,32.72 v40.9,34.3 | v59.98,25.67 64.04,25.67 64.8,26.43 65.45,26.43 65.98,26.96 66.7,26.96 67.81,28.07 67.81,29.13 69.3,30.62 v69.75,30.62 | v41.08,29.79 41.11,29.79 43.1,27.8 43.1,26.67 43.63,26.14 50.46,26.14 51,25.6 51,24.18 v51.08,24.1
  Bottom 0.254: v51.08,24.1 57.54,24.1 59.12,25.68 59.96,25.68 arc-45 v59.98,25.67 | IC323.6 72.11,30.16 71.65,30.62 v69.75,30.62 | v40.9,34.3 41.08,34.12 v41.08,29.79
N$1
  Top 0.254: C3P01.1 53.01,23.53 UA2.NR
N$2
  Bottom 0.254: C3M04.1 17.9,15.58 13.86,15.58 13.69,15.41 G301.VREF_CAP
N$3
  Bottom 0.254: C3M03.1 18.51,19.03 18.06,19.48 15.85,19.48 15.5,19.13 G301.BW_CAP
N$4
  Top 0.254: R3A17.1 23.82,82.99 LD301.C
N$5  (via drill 0.6)
  Top 0.254: v6.63,18.81 9.15,21.33 v9.15,21.84
  Bottom 0.254: G301.RATE_OUT 13.69,19.2 12.75,20.14 12.75,20.64 12.35,21.04 11.22,21.04 10.64,21.62 9.37,21.62 v9.15,21.84 | R3M02.1 11.7,8.37 5.71,14.36 5.71,18.03 6.49,18.81 v6.63,18.81
N$6  (via drill 0.7)
  Top 0.254: IC302.3 9.46,17.16 8.85,16.55 8.85,12.28 9.67,11.46 10.78,11.46 v11.45,10.79
  Bottom 0.254: R3M02.2 | C3M05.1 17.18,8.67 15.86,8.67 15.34,9.19 15.34,9.66 14.93,10.07 R3M02.2 | v11.45,10.79 13.24,10.79 R3M02.2
N$7
  Top 0.254: Q31.2 C3A03.1
  Bottom 0.254: H801.67 34.64,32.16 35,31.8 35,31 35.4,30.6 37.16,30.6 Q31.2
N$8  (via drill 0.7)
  Top 0.254: v9.97,23.11 9.71,22.85 R3M03.1 4.11,20.79 4.11,16.32 5.43,15 6.99,15 7.6,15.61 7.6,17.36 8.68,18.44 IC302.2
  Bottom 0.254: v9.97,23.11 11.27,23.11 arc-45 R3M04.1
N$9  (via drill 0.7)
  Top 0.254: C3A04.1 R3A11.1 39.65,43.24 39.5,43.39 39.5,43.8 40.75,45.05 D301.A 38.14,47.07 37.66,46.59 37.66,41.14 35.44,38.92 35.44,37.22 arc-45 35.37,37.04 33.31,34.98 v31.4,34.98
  Bottom 0.254: H801.63 32.22,34.16 v31.4,34.98
N$10
  Bottom 0.254: H801.1 16.02,28.16 C3A01.1
N$11
  Top 0.254: R3M05.2 14.18,21.32 IC302.8
N$12
  Top 0.254: IC302.1 10.73,19.7 R3M05.1
N$13
  Bottom 0.254: H801.6 16.49,30.66 R3A09.1
N$14
  Bottom 0.254: R3A12.1 H801.89
N$15
  Top 0.254: TMP301.2 48.22,66.01 48.75,66.54 49.73,66.54 R3J01.2
N$16
  Top 0.254: IC306.4 IC306.3
N$17
  Bottom 0.254: R3I01.2 60.75,66.76 61.61,65.9 TMP302.VOUT
N$18
  Top 0.254: R3L05.2 82.42,19.9 81.85,20.47 MAG301.CS
N$19
  Top 0.254: IC306.6 IC306.9 IC306.10
N$20
  Top 0.254: R3H01.2 73.11,65.76 72.23,64.88 TMP303.2
N$21
  Bottom 0.254: G301.SEL0 10.99,19.35 10.83,19.46 | R3M01.2 10.83,19.46 | G301.SEL1 12.78,19.12 12.44,19.46 10.83,19.46
N$22
  Top 0.254: C3A02.1 36.43,34.69 Q31.1
  Bottom 0.254: H801.66 34.76,32.66 35.1,33 35.1,35 35.6,35.5 37.24,35.5 Q31.1
N$23  (via drill 0.6)
  Route2 0.254: v10.8,37.2 10.8,38.7 14.8,42.7 14.8,45 17.3,47.5 36.6,47.5 40.38,51.28 53.22,51.28 54.7,49.8 54.7,45.9 55.8,44.8 59.3,44.8 59.7,45.2 62.5,45.2 63.6,46.3 67.7,46.3 v70.5,49.1
  Bottom 0.254: H801.16 12.04,35.66 v10.8,37.2 | v70.5,49.1 HCONM.A44
N$24
  Bottom 0.254: G302.VREF_CAP 35.42,8.56 35.76,8.22 35.76,7.56 C3N04.1
N$25  (via drill 0.6)
  Top 0.254: v62.11,76.31 62.68,76.88 R3G01.2